# Altium project eps.PrjPCB (part 1 of 2)
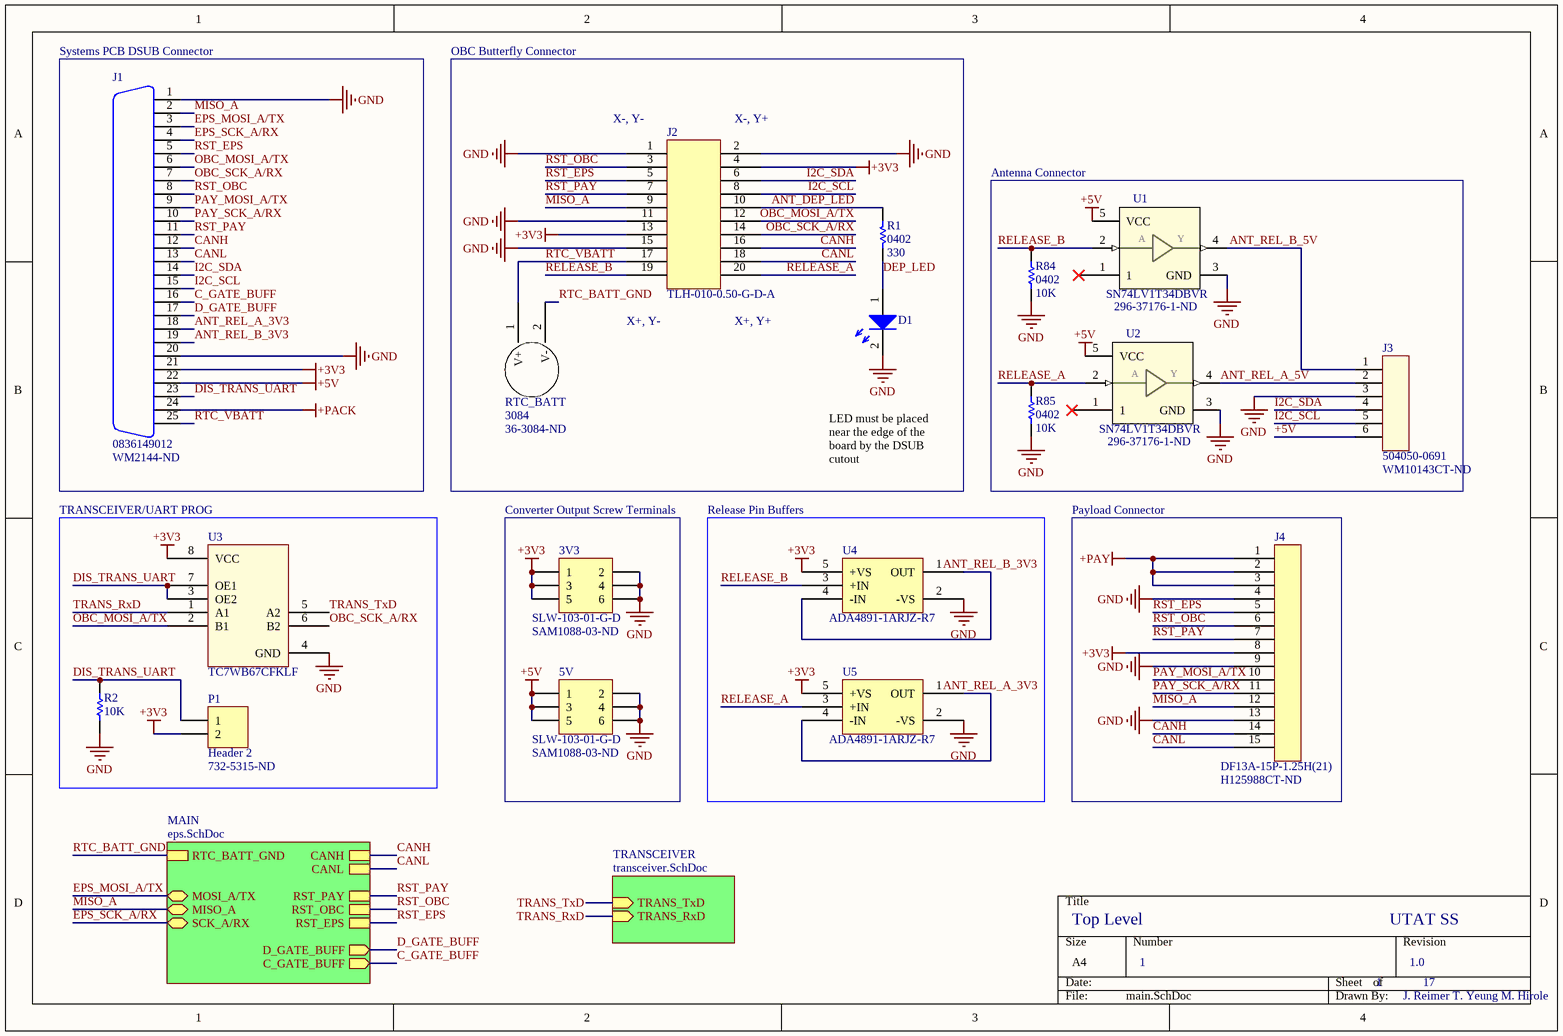
[diagram p0: main.SchDoc]
13 sheets, 165 parts. Net scope: hierarchical (ports join the sheet entries above them; power ports are global).
Board files: eps.PcbDoc, eps-flight.PcbDoc
Sheets:
  main.SchDoc
    MAIN = eps.SchDoc
      DIGITAL = eps_digital.SchDoc
        HEATERS AND SENSORS = heaters-sensors.SchDoc
        IMU = eps_imu.SchDoc
      BATTERY = batt.SchDoc
        LOAD SWITCHES = dep-switches.SchDoc
          DEP+ = dep-switch-TPS22959DNYT.SchDoc
          DEP- = dep-switch-TPS22959DNYT.SchDoc
          PAY LOAD SWITCH = dep-switch-TPS22959DNYT.SchDoc
        CURRENT LIMITER = current-limiter.SchDoc
        RBF = dep-switch-TPS22959DNYT.SchDoc
      BOOST = boost.SchDoc
      BUCK-BOOST = buck_boost.SchDoc
      SOLAR PANELS = solar.SchDoc
    TRANSCEIVER = transceiver.SchDoc

## Sheet main.SchDoc: Top Level
size A4; DrawnBy: J. Reimer T. Yeung M. Hirole; Organization: UTAT SS; DocumentNumber: 1; Revision: 1.0; SheetNumber: 1; SheetTotal: 17

### Parts
3V3  SLW-103-01-G-D  Supplier Part Number 1: SAM1088-03-ND  [SLW-103-01-X-D]
5V  SLW-103-01-G-D  Supplier Part Number 1: SAM1088-03-ND  [SLW-103-01-X-D]
D1  (no value)  [LED0603]
J1  0836149012  Supplier Part Number 1: WM2144-ND  [0836149012]
J2  TLH-010-0.50-G-D-A  [TLH-010-0.50-G-D-A]
J3  504050-0691  Supplier Part Number 1: WM10143CT-ND  [MOLEX_504050-0691]
J4  DF13A-15P-1.25H(21)  Supplier Part Number 1: H125988CT-ND  [DF13A-15P-1.25H(21)]
P1  Header 2  Supplier Part Number 1: 732-5315-ND  [HDR1X2]
R1  0402  value 330  [RES0402R]
R2  value 10K  [RES0402R]  (hidden comment: 0402)
R84  0402  value 10K  [RES0402R]
R85  0402  value 10K  [RES0402R]
RTC_BATT  3084  Supplier Part Number 1: 36-3084-ND  [3084]
U1  SN74LV1T34DBVR  Supplier Part Number 1: 296-37176-1-ND  [SOT95P280X145-5N]
U2  SN74LV1T34DBVR  Supplier Part Number 1: 296-37176-1-ND  [SOT95P280X145-5N]
U3  TC7WB67CFKLF  [US8]
U4  ADA4891-1ARJZ-R7  [SOT-23-5]
U5  ADA4891-1ARJZ-R7  [SOT-23-5]

### Blocks framed on the sheet
Systems PCB DSUB Connector: J1
Antenna Connector: J3 R84 R85 U1 U2
TRANSCEIVER/UART PROG: P1 R2 U3
Converter Output Screw Terminals: 3V3 5V
Release Pin Buffers: U4 U5
Payload Connector: J4

### Sub-sheets
MAIN = eps.SchDoc: RST_PAY, RST_OBC, RST_EPS, SCK_A/RX (bidir), MOSI_A/TX (bidir), MISO_A (bidir), CANL, CANH, RTC_BATT_GND, D_GATE_BUFF (out), C_GATE_BUFF (out)
TRANSCEIVER = transceiver.SchDoc: TRANS_RxD (in), TRANS_TxD (in)

### Nets
+3V3: 3V3.1 3V3.3 3V3.5 J1.21 J2.4 J2.13 J4.8 P1.2 U3.8(VCC) U4.5(+VS) U5.5(+VS)
+5V: 5V.1 5V.3 5V.5 J1.22 J3.6 U1.5(VCC) U2.5(VCC)
+PACK: J1.24
+PAY: J4.1 J4.2 J4.3
GND: 3V3.2 3V3.4 3V3.6 5V.2 5V.4 5V.6 D1.2 J1.1 J1.20 J2.1 J2.2 J2.11 J2.15 J3.3 J4.4 J4.9 J4.13 R2.2 R84.1 R85.1 U1.3(GND) U2.3(GND) U3.4(GND) U4.2(-VS) U5.2(-VS)
RTC_BATT_GND: RTC_BATT.2(V-) ; sheet MAIN/RTC_BATT_GND  [project net -PACK_RAW]
ANT_DEP_LED: J2.10 R1.2
ANT_REL_A_3V3: J1.18 U5.1(OUT) U5.4(-IN)
ANT_REL_A_5V: J3.2 U2.4(Y)
ANT_REL_B_3V3: J1.19 U4.1(OUT) U4.4(-IN)
ANT_REL_B_5V: J3.1 U1.4(Y)
C_GATE_BUFF: J1.16 ; sheet MAIN/C_GATE_BUFF
CANH: J1.12 J2.16 J4.14 ; sheet MAIN/CANH
CANL: J1.13 J2.18 J4.15 ; sheet MAIN/CANL
D_GATE_BUFF: J1.17 ; sheet MAIN/D_GATE_BUFF
DEP_LED: D1.1 R1.1
DIS_TRANS_UART: J1.23 P1.1 R2.1 U3.3(OE2) U3.7(OE1)
EPS_MOSI_A/TX: J1.3 ; sheet MAIN/MOSI_A/TX
EPS_SCK_A/RX: J1.4 ; sheet MAIN/SCK_A/RX
I2C_SCL: J1.15 J2.8 J3.5
I2C_SDA: J1.14 J2.6 J3.4
MISO_A: J1.2 J2.9 J4.12 ; sheet MAIN/MISO_A
OBC_MOSI_A/TX: J1.6 J2.12 U3.2(B1)
OBC_SCK_A/RX: J1.7 J2.14 U3.6(B2)
PAY_MOSI_A/TX: J1.9 J4.10
PAY_SCK_A/RX: J1.10 J4.11
RELEASE_A: J2.20 R85.2 U2.2(A) U5.3(+IN)
RELEASE_B: J2.19 R84.2 U1.2(A) U4.3(+IN)
RST_EPS: J1.5 J2.5 J4.5 ; sheet MAIN/RST_EPS
RST_OBC: J1.8 J2.3 J4.6 ; sheet MAIN/RST_OBC
RST_PAY: J1.11 J2.7 J4.7 ; sheet MAIN/RST_PAY
RTC_VBATT: J1.25 J2.17 RTC_BATT.1(V+)
TRANS_RxD: U3.1(A1) ; sheet TRANSCEIVER/TRANS_RxD
TRANS_TxD: U3.5(A2) ; sheet TRANSCEIVER/TRANS_TxD

Not connected (* = marked no-connect by the designer): U1 1*; U2 1*

### Notes on the sheet
- OBC Butterfly Connector
- (near J2) X-, Y-
- (near J2) X-, Y+
- (near J2) X+, Y-
- (near J2) X+, Y+
- LED must be placed near the edge of the board by the DSUB cutout

### Library data of the parts
3V3 5V = SLW-103-01-G-D: 6 pos 100mil pitch low profile header; Supplier 1: Digi-Key
D1 = LED: Just a generic LED
J1 = 0836149012: Mini-DSUB 25-pos Connector; Supplier 1: Digi-Key
J2 = TLH-010-0.50-G-D-A: 0.50 mm Razor Beam LP Ultra Low Profile Terminal Strip, alignment pin option; Supplier 1: Samtec; ComponentLink1Description: Product Page; ComponentLink1URL: https://www.samtec.com/products/tlh-010-0.50-g-d-a; Supplier Part Number 1: TLH-010-0.50-G-D-A
J3 = 504050-0691: Wire-To-Board Connector, Pico-Lock 504050 Series, Surface Mount, Header, 6, 1.5 mm; Supplier 1: Digi-Key
J4 = DF13A-15P-1.25H(21): 15 pos DF13 right angle surface mount connector; Supplier 1: Digi-Key
P1 = Header 2: Header, 2-Pin; LatestRevisionDate: 17-Jul-2002; LatestRevisionNote: Re-released for DXP Platform.; Publisher: Altium Limited; Supplier 1: Digi-Key
R1 R2 R84 R85 = RES0402: 0402 resistor
RTC_BATT = 3084: CR2330 Battery Holder; Manufacturer: Keystone Electronics; Number of Batteries: 2; Number of Cells: 1; Supplier 1: Digi-Key; Manufacturer Part Number: 3084; Stock 1: 658; Pricing 1: 1=0.62, 10=0.523, 50=0.4586, 250=0.39796, 500=0.391, 1000=0.34946, 2500=0.31916, 5000=0.29492 (USD); Mount: Surface Mount,PCB; Case/Package: SMD/SMT; Package Quantity: 100; Termination: SMD/SMT; Lead Free: Lead Free; REACH SVHC: No SVHC; ComponentLink1URL: http://media.digikey.com/pdf/Data%20Sheets/Keystone%20Electronics%20PDFs/Lithium_Coin_Cell_Retainers_SMT.pdf?src-supplier=Digi-Key; ComponentLink1Description: http://media.digikey.com/pdf/Data%20Sheets/Keystone%20Electronics%20PDFs/Lithium_Coin_Cell_Retainers_SMT.pdf?src-supplier=Digi-Key
U1 U2 = SN74LV1T34DBVR: Single Power Supply BUFFER Logic Level Shifter _no enable_ 5-SOT-23 -40 to 125; MF: Texas Instruments; Number of Elements: 1; Logic Function: Buffer,Inverting; Max Supply Voltage: 5.5V; Min Supply Voltage: 1.6V; High Level Output Current: -8mA; Low Level Output Current: 8mA; Polarity: Non-Inverting; Propagation Delay: 15.5ns; Quiescent Current: 1uA; SnapEDA_Link: https://www.snapeda.com/parts/SN74LV1T34DBVR/Texas%20Instruments/view-part/?ref=snap; MP: SN74LV1T34DBVR; Package: SOT-23 Texas Instruments; Digi-Key_Purchase_URL: https://www.digikey.ca/product-detail/en/texas-instruments/SN74LV1T34DBVR/296-37176-1-ND/4555593?utm_source=snapeda&utm_medium=aggregator&utm_campaign=symbol; Digi-Key_Part_Number: 296-37176-1-ND; Value: *; Supplier 1: Digi-Key; Manufacturer: Texas Instruments; Manufacturer Part Number: SN74LV1T34DBVR; Stock 1: 39936; Pricing 1: 1=0.47, 10=0.378, 100=0.2571, 500=0.19282, 1000=0.14461 (USD); Mount: Surface Mount; Case/Package: SOT-23-5; Number of Pins: 5; Weight: 0.000353oz; Min Operating Temperature: -40°C; Max Operating Temperature: 125°C; Package Quantity: 3000; Packaging: Tape and Reel; Number of Bits per Element: 1; Number of Input Lines: 1; Number of Output Lines: 1; Operating Supply Current: 8mA; Number of Channels: 1; Number of Inputs: 1; Number of Outputs: 1; Number of Bits: 1; Radiation Hardening: No; REACH SVHC: No SVHC; Lead Free: Lead Free; ComponentLink1URL: http://www.ti.com/lit/pdf/sdyu001?src-supplier=Digi-Key; ComponentLink1Description: http://www.ti.com/lit/pdf/sdyu001?src-supplier=Digi-Key; ComponentLink2URL: http://www.ti.com/lit/ds/symlink/sn74lv1t34.pdf?src-supplier=Avnet; ComponentLink2Description: http://www.ti.com/lit/ds/symlink/sn74lv1t34.pdf?src-supplier=Avnet
U3 = TC7WB66CFKLF: Active high bus switch; Manufacturer: Toshiba; Manufacturer Part Number: TC7WB67CFK,LF(CT; Supplier 1: Digi-Key; Supplier 2: Digi-Key; Stock 2: 5593; Pricing 2: 1=0.41, 10=0.32, 25=0.27, 100=0.2199, 250=0.1822, 500=0.1508, 1000=0.11309 (USD); Supplier Part Number 2: TC7WB67CFKLF(CTCT-ND
U4 U5 = ADA4891-1ARJZ-R7: Rail-to-rail amplifier 125mA max; Vendor: Analog Devices Inc; Built_By: EMA_UL_Team; Manufacturer_Part_Number: ADA4891-1ARJZ-R7; Copyright: Copyright (C) 2018 Accelerated Designs. All rights reserved; RefDes: RefDes; Type: DEV; Value: Value; Supplier 1: Digi-Key; Supplier Part Number 1: ADA4891-1ARJZ-R7CT-ND

## Sheet eps.SchDoc: Power Top Level
size A; DrawnBy: J. Reimer T. Yeung M. Hirole; Organization: UTAT SS; DocumentNumber: 2; Revision: 1.0; SheetNumber: 2; SheetTotal: 17
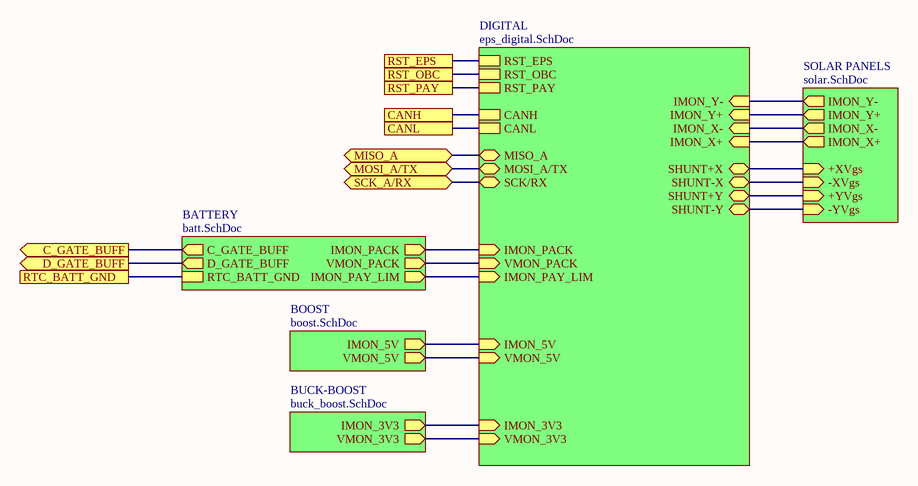
[diagram p1: eps.SchDoc]

### Sub-sheets
BATTERY = batt.SchDoc: IMON_PACK (out), VMON_PACK (out), RTC_BATT_GND, C_GATE_BUFF (out), D_GATE_BUFF (out), IMON_PAY_LIM (out)
BOOST = boost.SchDoc: VMON_5V (out), IMON_5V (out)
BUCK-BOOST = buck_boost.SchDoc: IMON_3V3 (out), VMON_3V3 (out)
DIGITAL = eps_digital.SchDoc: RST_EPS, RST_OBC, RST_PAY, CANH, CANL, MISO_A (bidir), MOSI_A/TX (bidir), SCK/RX (bidir), VMON_5V (in), IMON_5V (in), IMON_3V3 (in), IMON_X+ (in), IMON_X- (in), IMON_Y+ (in), VMON_PACK (in), IMON_Y- (in), SHUNT-Y (bidir), SHUNT+Y (bidir), VMON_3V3 (in), SHUNT-X (bidir), SHUNT+X (bidir), IMON_PACK (in), IMON_PAY_LIM (in)
SOLAR PANELS = solar.SchDoc: IMON_Y+ (out), IMON_Y- (out), -YVgs (in), IMON_X+ (out), +YVgs (in), +XVgs (in), -XVgs (in), IMON_X- (out)

### Ports
C_GATE_BUFF (out), CANH, CANL, D_GATE_BUFF (out), MISO_A (bidir), MOSI_A/TX (bidir), RST_EPS, RST_OBC, RST_PAY, RTC_BATT_GND, SCK_A/RX (bidir)

### Nets
-PACK_RAW: port RTC_BATT_GND, sheet BATTERY/RTC_BATT_GND
C_GATE_BUFF: port C_GATE_BUFF, sheet BATTERY/C_GATE_BUFF
CANH: port CANH, sheet DIGITAL/CANH
CANL: port CANL, sheet DIGITAL/CANL
D_GATE_BUFF: port D_GATE_BUFF, sheet BATTERY/D_GATE_BUFF
EPS_MOSI_A/TX: port MOSI_A/TX, sheet DIGITAL/MOSI_A/TX
EPS_SCK_A/RX: port SCK_A/RX, sheet DIGITAL/SCK/RX
G1: sheet DIGITAL/SHUNT+X, sheet SOLAR PANELS/+XVgs
G2: sheet DIGITAL/SHUNT-X, sheet SOLAR PANELS/-XVgs
G3: sheet DIGITAL/SHUNT+Y, sheet SOLAR PANELS/+YVgs
G4: sheet DIGITAL/SHUNT-Y, sheet SOLAR PANELS/-YVgs
IMON_3V3: sheet DIGITAL/IMON_3V3, sheet BUCK-BOOST/IMON_3V3
IMON_5V: sheet DIGITAL/IMON_5V, sheet BOOST/IMON_5V
MISO_A: port MISO_A, sheet DIGITAL/MISO_A
PACK_IMON: sheet DIGITAL/IMON_PACK, sheet BATTERY/IMON_PACK
PACK_VMON: sheet DIGITAL/VMON_PACK, sheet BATTERY/VMON_PACK
RST_EPS: port RST_EPS, sheet DIGITAL/RST_EPS
RST_OBC: port RST_OBC, sheet DIGITAL/RST_OBC
RST_PAY: port RST_PAY, sheet DIGITAL/RST_PAY
VMON_3V3: sheet DIGITAL/VMON_3V3, sheet BUCK-BOOST/VMON_3V3
VMON_5V: sheet DIGITAL/VMON_5V, sheet BOOST/VMON_5V
NetR83_2: sheet DIGITAL/IMON_PAY_LIM, sheet BATTERY/IMON_PAY_LIM
(unnamed): sheet DIGITAL/IMON_X+, sheet SOLAR PANELS/IMON_X+
(unnamed): sheet DIGITAL/IMON_X-, sheet SOLAR PANELS/IMON_X-
(unnamed): sheet DIGITAL/IMON_Y+, sheet SOLAR PANELS/IMON_Y+
(unnamed): sheet DIGITAL/IMON_Y-, sheet SOLAR PANELS/IMON_Y-

## Sheet eps_digital.SchDoc: Digital Top Level
size A4; DrawnBy: J. Reimer T. Yeung M. Au; Organization: UTAT SS; DocumentNumber: 7; Revision: 2.0; SheetNumber: 7; SheetTotal: 17
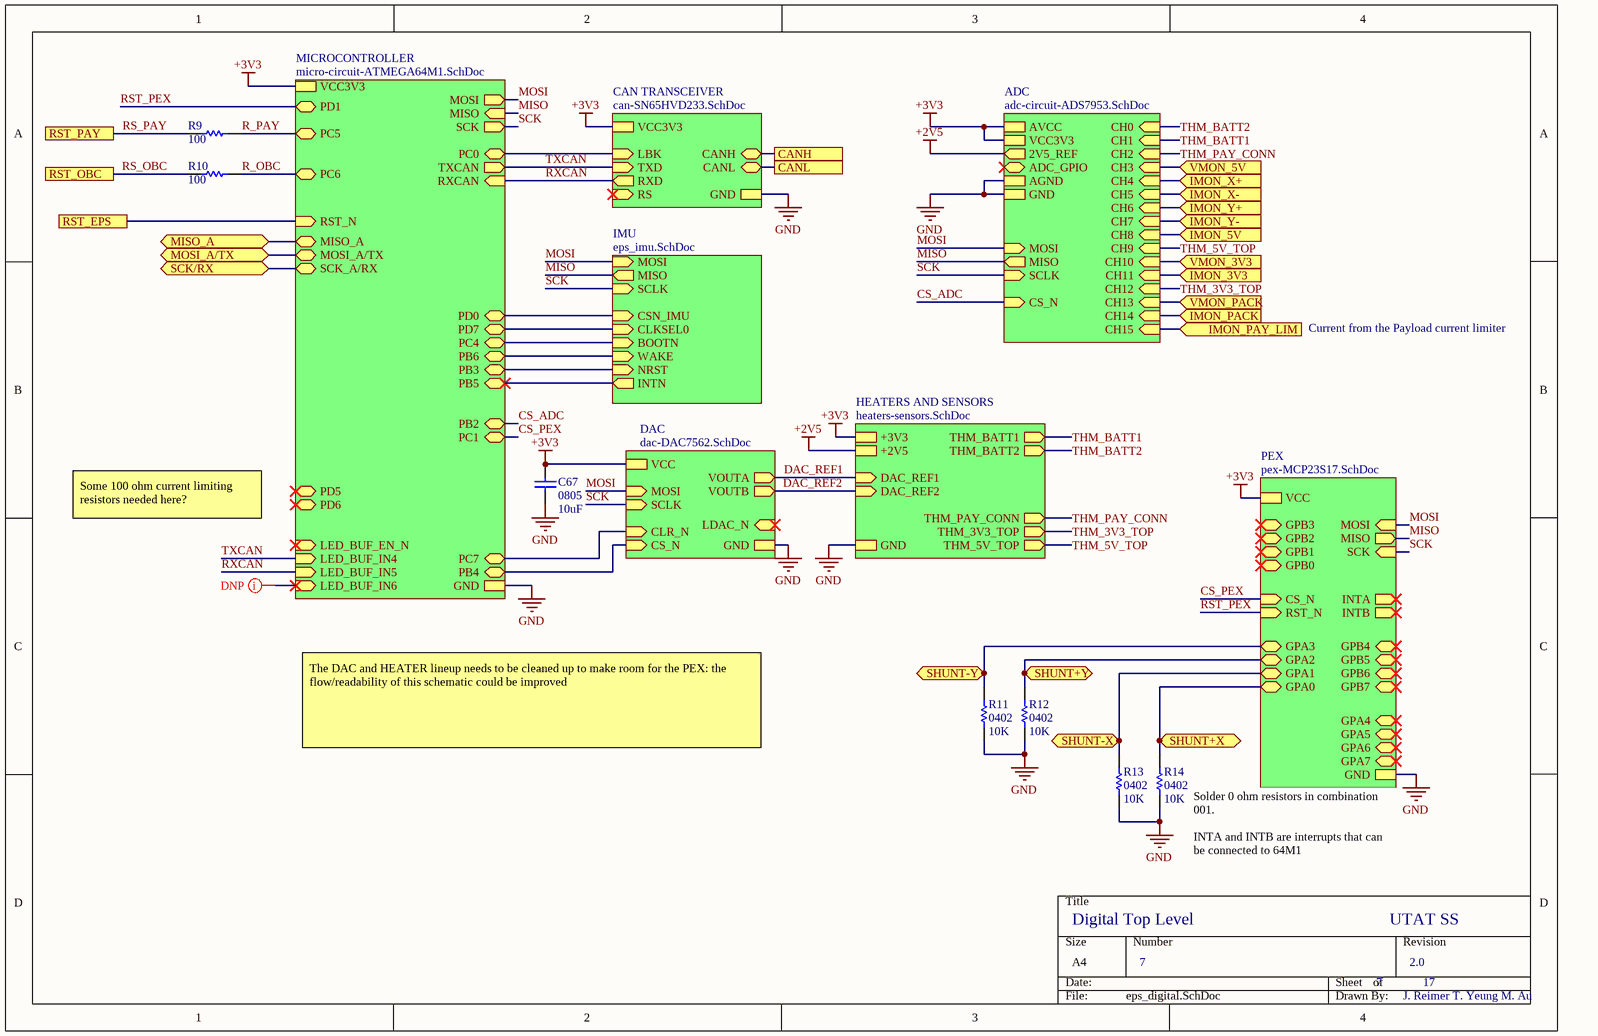
[diagram p2: eps_digital.SchDoc]

### Parts
C67  0805  value 10uF  [CAP0805R]
R9  value 100  [RES0402R]  (hidden comment: 0402)
R10  value 100  [RES0402R]  (hidden comment: 0402)
R11  0402  value 10K  [RES0402R]
R12  0402  value 10K  [RES0402R]
R13  0402  value 10K  [RES0402R]
R14  0402  value 10K  [RES0402R]

### Sub-sheets
ADC = adc-circuit-ADS7953.SchDoc (file not in this document): CH10 (in), CH11 (in), CH9 (in), CH5 (in), CH6 (in), CH7 (in), CH3 (in), CH2 (in), CH8 (in), CH4 (in), CH1 (in), CH0 (in), CS_N (in), AVCC, ADC_GPIO (bidir), 2V5_REF (out), VCC3V3, AGND, GND, MISO (out), MOSI (in), SCLK (in), CH12 (in), CH14 (in), CH13 (in), CH15 (in)
CAN TRANSCEIVER = can-SN65HVD233.SchDoc (file not in this document): RXD (out), TXD (in), LBK (in), CANL (bidir), CANH (bidir), RS (in), VCC3V3, GND
DAC = dac-DAC7562.SchDoc (file not in this document): MOSI (in), CLR_N (in), SCLK (in), CS_N (in), VOUTB (out), VOUTA (out), VCC, GND, LDAC_N (in)
HEATERS AND SENSORS = heaters-sensors.SchDoc: +2V5, DAC_REF1 (in), GND, DAC_REF2 (in), +3V3, THM_BATT1 (out), THM_BATT2 (out), THM_3V3_TOP (out), THM_5V_TOP (out), THM_PAY_CONN (out)
IMU = eps_imu.SchDoc: NRST (in), CSN_IMU (in), MISO (out), CLKSEL0 (in), WAKE (in), BOOTN (in), INTN (out), SCLK (in), MOSI (in)
MICROCONTROLLER = micro-circuit-ATMEGA64M1.SchDoc (file not in this document): MOSI_A/TX (bidir), TXCAN (out), RXCAN (in), SCK_A/RX (bidir), PC6 (bidir), PC5 (bidir), PD1 (bidir), PB5 (bidir), PC1 (bidir), PB2 (bidir), RST_N (in), PC0 (bidir), MISO_A (bidir), PB4 (bidir), PD7 (bidir), PB3 (bidir), VCC3V3, PB6 (bidir), PD6 (bidir), GND, LED_BUF_IN6 (in), LED_BUF_IN5 (in), LED_BUF_IN4 (in), LED_BUF_EN_N (in), PD0 (bidir), PD5 (bidir), PC4 (bidir), PC7 (bidir), MISO (in), SCK (out), MOSI (out)
PEX = pex-MCP23S17.SchDoc (file not in this document): GPB0 (bidir), GPB1 (bidir), GPB2 (bidir), GPB3 (bidir), GPA1 (bidir), GPA2 (bidir), GPA0 (bidir), GPA3 (bidir), CS_N (in), RST_N (in), MISO (out), MOSI (in), SCK (in), GND, INTB (out), INTA (out), VCC, GPB6 (bidir), GPA6 (bidir), GPB5 (bidir), GPB7 (bidir), GPA4 (bidir), GPA5 (bidir), GPA7 (bidir), GPB4 (bidir)

### Ports
CANH, CANL, IMON_3V3 (in), IMON_5V (in), IMON_PACK (in), IMON_PAY_LIM (in), IMON_X+ (in), IMON_X- (in), IMON_Y+ (in), IMON_Y- (in), MISO_A (bidir), MOSI_A/TX (bidir), RST_EPS, RST_OBC, RST_PAY, SCK/RX (bidir), SHUNT+X (bidir), SHUNT+Y (bidir), SHUNT-X (bidir), SHUNT-Y (bidir), VMON_3V3 (in), VMON_5V (in), VMON_PACK (in)

### Nets
+2V5: sheet ADC/2V5_REF, sheet HEATERS AND SENSORS/+2V5
+3V3: C67.2 ; sheet MICROCONTROLLER/VCC3V3, sheet DAC/VCC, sheet ADC/AVCC, sheet ADC/VCC3V3, sheet HEATERS AND SENSORS/+3V3, sheet CAN TRANSCEIVER/VCC3V3, sheet PEX/VCC
GND: C67.1 R11.1 R12.1 R13.1 R14.1 ; sheet MICROCONTROLLER/GND, sheet DAC/GND, sheet ADC/AGND, sheet ADC/GND, sheet HEATERS AND SENSORS/GND, sheet CAN TRANSCEIVER/GND, sheet PEX/GND
CANH: port CANH, sheet CAN TRANSCEIVER/CANH
CANL: port CANL, sheet CAN TRANSCEIVER/CANL
CS_ADC: sheet MICROCONTROLLER/PB2, sheet ADC/CS_N
CS_PEX: sheet MICROCONTROLLER/PC1, sheet PEX/CS_N
DAC_REF1: sheet DAC/VOUTA, sheet HEATERS AND SENSORS/DAC_REF1
DAC_REF2: sheet DAC/VOUTB, sheet HEATERS AND SENSORS/DAC_REF2
EPS_MOSI_A/TX: port MOSI_A/TX, sheet MICROCONTROLLER/MOSI_A/TX
EPS_SCK_A/RX: port SCK/RX, sheet MICROCONTROLLER/SCK_A/RX
G1: R14.2 ; port SHUNT+X, sheet PEX/GPA0
G2: R13.2 ; port SHUNT-X, sheet PEX/GPA1
G3: R12.2 ; port SHUNT+Y, sheet PEX/GPA2
G4: R11.2 ; port SHUNT-Y, sheet PEX/GPA3
IMON_3V3: port IMON_3V3, sheet ADC/CH11
IMON_5V: port IMON_5V, sheet ADC/CH8
MISO: sheet MICROCONTROLLER/MISO, sheet ADC/MISO, sheet IMU/MISO, sheet PEX/MISO
MISO_A: port MISO_A, sheet MICROCONTROLLER/MISO_A
MOSI: sheet MICROCONTROLLER/MOSI, sheet DAC/MOSI, sheet ADC/MOSI, sheet IMU/MOSI, sheet PEX/MOSI
PACK_IMON: port IMON_PACK, sheet ADC/CH14
PACK_VMON: port VMON_PACK, sheet ADC/CH13
R_OBC: R10.2 ; sheet MICROCONTROLLER/PC6
R_PAY: R9.2 ; sheet MICROCONTROLLER/PC5
RS_OBC: R10.1 ; port RST_OBC  [project net RST_OBC]
RS_PAY: R9.1 ; port RST_PAY  [project net RST_PAY]
RST_EPS: port RST_EPS, sheet MICROCONTROLLER/RST_N
RST_PEX: sheet MICROCONTROLLER/PD1, sheet PEX/RST_N
RXCAN: sheet MICROCONTROLLER/RXCAN, sheet MICROCONTROLLER/LED_BUF_IN5, sheet CAN TRANSCEIVER/RXD
SCK: sheet MICROCONTROLLER/SCK, sheet DAC/SCLK, sheet ADC/SCLK, sheet IMU/SCLK, sheet PEX/SCK
THM_3V3_TOP: sheet ADC/CH12, sheet HEATERS AND SENSORS/THM_3V3_TOP
THM_5V_TOP: sheet ADC/CH9, sheet HEATERS AND SENSORS/THM_5V_TOP
THM_BATT1: sheet ADC/CH1, sheet HEATERS AND SENSORS/THM_BATT1
THM_BATT2: sheet ADC/CH0, sheet HEATERS AND SENSORS/THM_BATT2
THM_PAY_CONN: sheet ADC/CH2, sheet HEATERS AND SENSORS/THM_PAY_CONN
TXCAN: sheet MICROCONTROLLER/TXCAN, sheet MICROCONTROLLER/LED_BUF_IN4, sheet CAN TRANSCEIVER/TXD
VMON_3V3: port VMON_3V3, sheet ADC/CH10
VMON_5V: port VMON_5V, sheet ADC/CH3
NetR47_1: sheet MICROCONTROLLER/PC4, sheet IMU/BOOTN
NetR48_1: sheet MICROCONTROLLER/PD0, sheet IMU/CSN_IMU
NetR83_2: port IMON_PAY_LIM, sheet ADC/CH15
NetU13_6: sheet MICROCONTROLLER/PB6, sheet IMU/WAKE
NetU13_10: sheet MICROCONTROLLER/PD7, sheet IMU/CLKSEL0
NetU13_11: sheet MICROCONTROLLER/PB3, sheet IMU/NRST
NetU13_14: sheet MICROCONTROLLER/PB5, sheet IMU/INTN
(unnamed): port IMON_X+, sheet ADC/CH4
(unnamed): port IMON_X-, sheet ADC/CH5
(unnamed): port IMON_Y+, sheet ADC/CH6
(unnamed): port IMON_Y-, sheet ADC/CH7
(unnamed): sheet MICROCONTROLLER/PC0, sheet CAN TRANSCEIVER/LBK
(unnamed): sheet MICROCONTROLLER/PB4, sheet DAC/CS_N
(unnamed): sheet MICROCONTROLLER/PC7, sheet DAC/CLR_N

### Layout directives
mark named DNP: (no net found under the mark)

### Notes on the sheet
- Current from the Payload current limiter
- Some 100 ohm current limiting resistors needed here?
- The DAC and HEATER lineup needs to be cleaned up to make room for the PEX: the flow/readability of this schematic could be improved
- (near R14) Solder 0 ohm resistors in combination 001.
  INTA and INTB are interrupts that can be connected to 64M1

### Library data of the parts
C67 = CAP0805: 0805 capacitor
R9-R14 = RES0402: 0402 resistor

## Sheet heaters-sensors.SchDoc
size A4
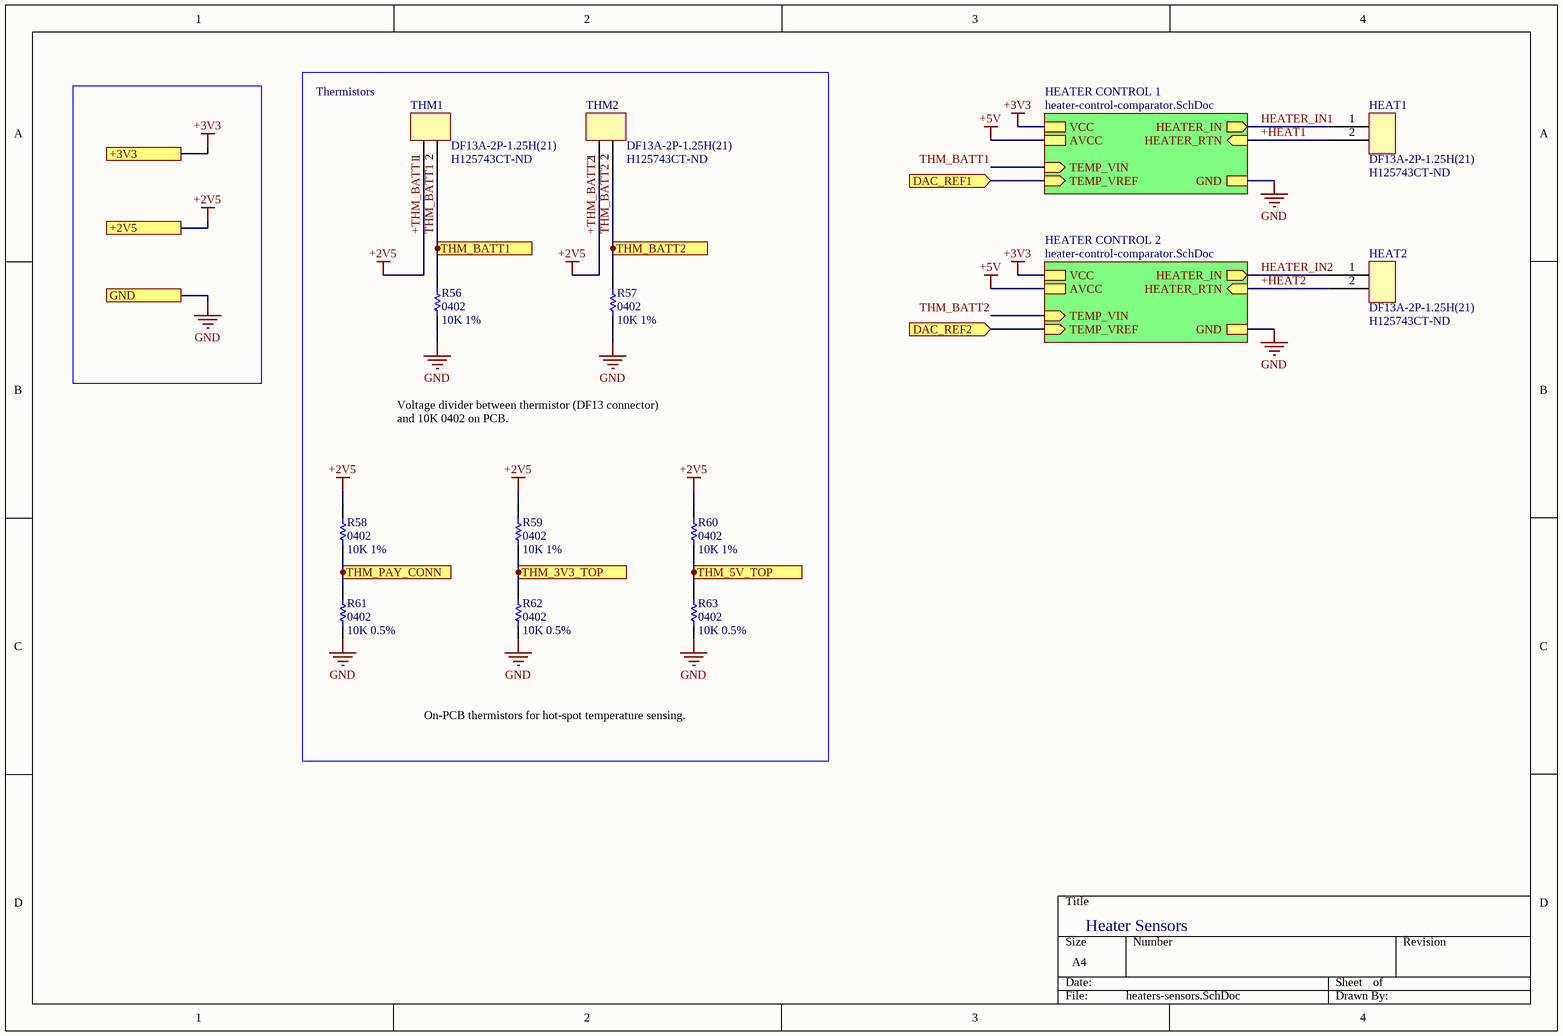
[diagram p3: heaters-sensors.SchDoc]

### Parts
HEAT1  DF13A-2P-1.25H(21)  Supplier Part Number 1: H125743CT-ND  [DF13A-2P-1.25H(21)]
HEAT2  DF13A-2P-1.25H(21)  Supplier Part Number 1: H125743CT-ND  [DF13A-2P-1.25H(21)]
R56  0402  value 10K 1%  [RES0402R]
R57  0402  value 10K 1%  [RES0402R]
R58  0402  value 10K 1%  [RES0402R]
R59  0402  value 10K 1%  [RES0402R]
R60  0402  value 10K 1%  [RES0402R]
R61  0402  value 10K 0.5%  [RES0402R]
R62  0402  value 10K 0.5%  [RES0402R]
R63  0402  value 10K 0.5%  [RES0402R]
THM1  DF13A-2P-1.25H(21)  Supplier Part Number 1: H125743CT-ND  [DF13A-2P-1.25H(21)]
THM2  DF13A-2P-1.25H(21)  Supplier Part Number 1: H125743CT-ND  [DF13A-2P-1.25H(21)]

### Blocks framed on the sheet
Thermistors: R56-R63 THM1 THM2

### Sub-sheets
HEATER CONTROL 1 = heater-control-comparator.SchDoc (file not in this document): GND, TEMP_VIN (in), TEMP_VREF (in), HEATER_IN (out), VCC, AVCC, HEATER_RTN (in)
HEATER CONTROL 2 = heater-control-comparator.SchDoc (file not in this document): GND, TEMP_VIN (in), TEMP_VREF (in), HEATER_IN (out), VCC, AVCC, HEATER_RTN (in)

### Ports
+2V5, +3V3, DAC_REF1 (in), DAC_REF2 (in), GND, THM_3V3_TOP (out), THM_5V_TOP (out), THM_BATT1 (out), THM_BATT2 (out), THM_PAY_CONN (out)

### Nets
+2V5: R58.2 R59.2 R60.2 THM1.1 THM2.1 ; port +2V5  [also labelled +THM_BATT1, +THM_BATT2]
+3V3: port +3V3, sheet HEATER CONTROL 1/VCC, sheet HEATER CONTROL 2/VCC
+5V: sheet HEATER CONTROL 1/AVCC, sheet HEATER CONTROL 2/AVCC
GND: R56.1 R57.1 R61.1 R62.1 R63.1 ; port GND, sheet HEATER CONTROL 1/GND, sheet HEATER CONTROL 2/GND
+HEAT1: HEAT1.2 ; sheet HEATER CONTROL 1/HEATER_RTN
+HEAT2: HEAT2.2 ; sheet HEATER CONTROL 2/HEATER_RTN
DAC_REF1: port DAC_REF1, sheet HEATER CONTROL 1/TEMP_VREF
DAC_REF2: port DAC_REF2, sheet HEATER CONTROL 2/TEMP_VREF
HEATER_IN1: HEAT1.1 ; sheet HEATER CONTROL 1/HEATER_IN
HEATER_IN2: HEAT2.1 ; sheet HEATER CONTROL 2/HEATER_IN
THM_3V3_TOP: R59.1 R62.2 ; port THM_3V3_TOP
THM_5V_TOP: R60.1 R63.2 ; port THM_5V_TOP
THM_BATT1: R56.2 THM1.2 ; port THM_BATT1, sheet HEATER CONTROL 1/TEMP_VIN
THM_BATT2: R57.2 THM2.2 ; port THM_BATT2, sheet HEATER CONTROL 2/TEMP_VIN
THM_PAY_CONN: R58.1 R61.2 ; port THM_PAY_CONN

### Notes on the sheet
- Voltage divider between thermistor (DF13 connector) and 10K 0402 on PCB.
- On-PCB thermistors for hot-spot temperature sensing.
- Heater Sensors

### Library data of the parts
HEAT1 HEAT2 THM1 THM2 = DF13A-2P-1.25H(21): 2 pos DF13 right angle surface mount connector; Supplier 1: Digi-Key
R56-R60 = RES0402: 0402 resistor
R61-R63 = RES0402: 0402 thermistor; Supplier 1: Digi-Key; Supplier Part Number 1: 490-12810-1-ND

## Sheet eps_imu.SchDoc: Inertial Measurement Unit
size A; DrawnBy: Mohamed Hirole; Organization: UTAT SS; DocumentNumber: 8; Revision: 1.0; SheetNumber: 8; SheetTotal: 17
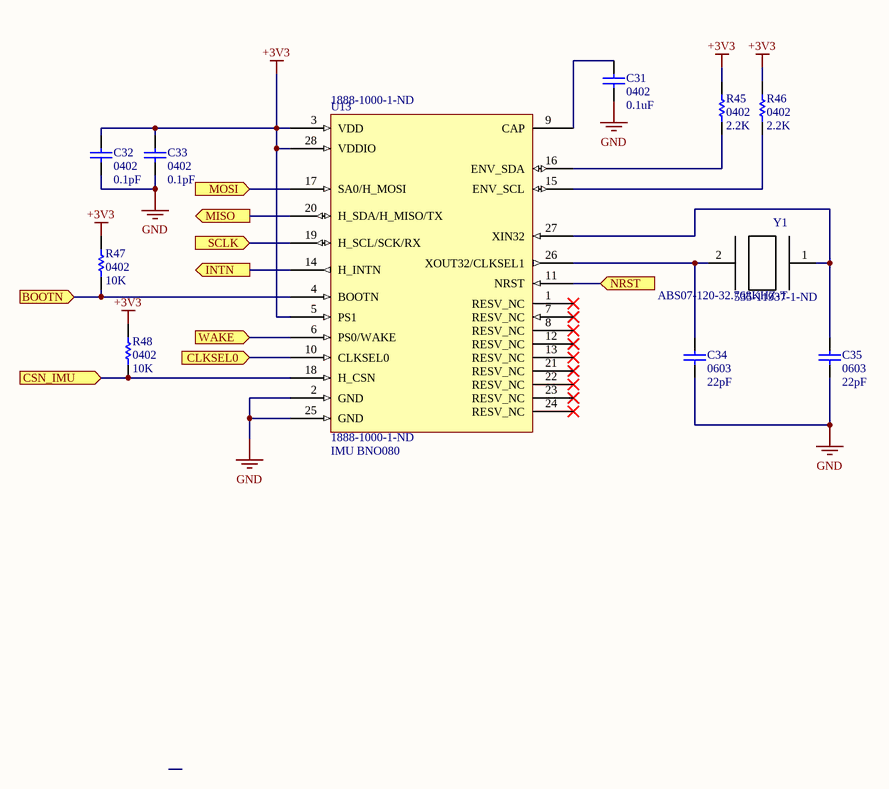
[diagram p4: eps_imu.SchDoc]

### Parts
C31  0402  value 0.1uF  [CAP0402R]
C32  0402  value 0.1pF  [CAP0402R]
C33  0402  value 0.1pF  [CAP0402R]
C34  0603  value 22pF  [CAP0603R]
C35  0603  value 22pF  [CAP0603R]
R45  0402  value 2.2K  [RES0402R]
R46  0402  value 2.2K  [RES0402R]
R47  0402  value 10K  [RES0402R]
R48  0402  value 10K  [RES0402R]
U13  IMU BNO080  [1888-1000-1-ND]
Y1  ABS07-120-32.768KHZ-T  Supplier Part Number 1: 535-11937-1-ND  [ABS07-120-32.768]

### Ports
BOOTN (in), CLKSEL0 (in), CSN_IMU (in), INTN (out), MISO (out), MOSI (in), NRST (in), SCLK (in), WAKE (in)

### Nets
+3V3: C32.2 C33.2 R45.2 R46.2 R47.2 R48.2 U13.3(VDD) U13.5(PS1) U13.28(VDDIO)
GND: C31.1 C32.1 C33.1 C34.1 C35.1 U13.2(GND) U13.25(GND)
MISO: U13.20(H_SDA/H_MISO/TX) ; port MISO
MOSI: U13.17(SA0/H_MOSI) ; port MOSI
SCK: U13.19(H_SCL/SCK/RX) ; port SCLK
NetC31_2: C31.2 U13.9(CAP)
NetC34_2: C34.2 U13.26(XOUT32/CLKSEL1) Y1.2
NetC35_2: C35.2 U13.27(XIN32) Y1.1
NetR45_1: R45.1 U13.16(ENV_SDA)
NetR46_1: R46.1 U13.15(ENV_SCL)
NetR47_1: R47.1 U13.4(BOOTN) ; port BOOTN
NetR48_1: R48.1 U13.18(H_CSN) ; port CSN_IMU
NetU13_6: U13.6(PS0/WAKE) ; port WAKE
NetU13_10: U13.10(CLKSEL0) ; port CLKSEL0
NetU13_11: U13.11(NRST) ; port NRST
NetU13_14: U13.14(H_INTN) ; port INTN

Not connected (* = marked no-connect by the designer): U13 1(RESV_NC)* 7(RESV_NC)* 8(RESV_NC)* 12(RESV_NC)* 13(RESV_NC)* 21(RESV_NC)* 22(RESV_NC)* 23(RESV_NC)* 24(RESV_NC)*

### Notes on the sheet
- (in symbol IMU BNO080) 1888-1000-1-ND

### Library data of the parts
C31-C33 = CAP0402: 0402 capacitor
C34 C35 = CAP0603: 0603 capacitor
R45-R48 = RES0402: 0402 resistor
U13 = IMU BNO080: ACCEL/GYRO/MAG I2C 32BIT; Manufacturer: Hillcrest Laboratories; Sensor Type: Accelerometer,Gyroscope,Magnetometer; Output Type: SPI,I2C; Supplier 1: Digi-Key; Manufacturer Part Number: BNO080; Stock 1: 10778; Pricing 1: 1=13.48, 5=11.826, 10=10.643, 25=9.46, 50=8.7506, 100=7.568, 500=7.095, 1000=6.622 (USD); Mount: Surface Mount; Case/Package: LGA; Min Operating Temperature: -40°C; Max Operating Temperature: 85°C; Packaging: Tape and Reel; Supplier Part Number 1: 1888-1000-1-ND
Y1 = ABS07-120-32.768KHZ-T: 3.2 x 1.5mm, 32.768KHZ Xtal 6pf, 20ppm, -40+85C, ESR 60kOhm, ST Micro Ref Design Crystal for STM32L; MF: Abracon; ESR (Equivalent Series Resistance): 55kR; Series Resistance: 60kR; MP: ABS07-120-32.768KHZ-T; SnapEDA_Link: https://www.snapeda.com/parts/ABS07-120-32.768KHZ-T/Abracon%20LLC/view-part/?ref=snap; Package: SMD-2 Abracon; Price: 0.37 USD; Availability: Good; Value: *; Supplier 1: Digi-Key; Manufacturer: Abracon; Manufacturer Part Number: ABS07-120-32.768KHZ-T; Stock 1: 213739; Pricing 1: 1=0.57, 10=0.473, 50=0.4258, 100=0.3784, 500=0.35948, 1000=0.30272 (USD); Mount: Surface Mount; Case/Package: SMD/SMT; Number of Pins: 2; Min Operating Temperature: -40°C; Max Operating Temperature: 85°C; Tolerance: 20ppm; Frequency: 32.768kHz; Load Capacitance: 6pF; Frequency Tolerance: 20ppm; Packaging: Tape and Reel; Package Quantity: 3000; Termination: SMD/SMT; Length: 3.2mm; Height: 0.035inch; Width: 0.061inch; Depth: 1.5mm; Radiation Hardening: No; REACH SVHC: No SVHC; Lead Free: Lead Free; ComponentLink1URL: https://www.verical.com/server-webapp/html/getDatasheet?partID=722402&src-supplier=Verical; ComponentLink1Description: https://www.verical.com/server-webapp/html/getDatasheet?partID=722402&src-supplier=Verical; ComponentLink2URL: https://abracon.com/Support/PackageDrawing/Resonators/ABS07-120.PDF?src-supplier=Digi-Key; ComponentLink2Description: https://abracon.com/Support/PackageDrawing/Resonators/ABS07-120.PDF?src-supplier=Digi-Key; ComponentLink3URL: http://www.mouser.com/ds/2/3/ABS07-120-32.768kHz-T-218607.pdf?src-supplier=Mouser; ComponentLink3Description: http://www.mouser.com/ds/2/3/ABS07-120-32.768kHz-T-218607.pdf?src-supplier=Mouser

## Sheet batt.SchDoc: Battery Protection
size A4; DrawnBy: J. Reimer T. Yeung M. Hirole; Organization: UTAT SS; DocumentNumber: 4; Revision: 2.0; SheetNumber: 4; SheetTotal: 17
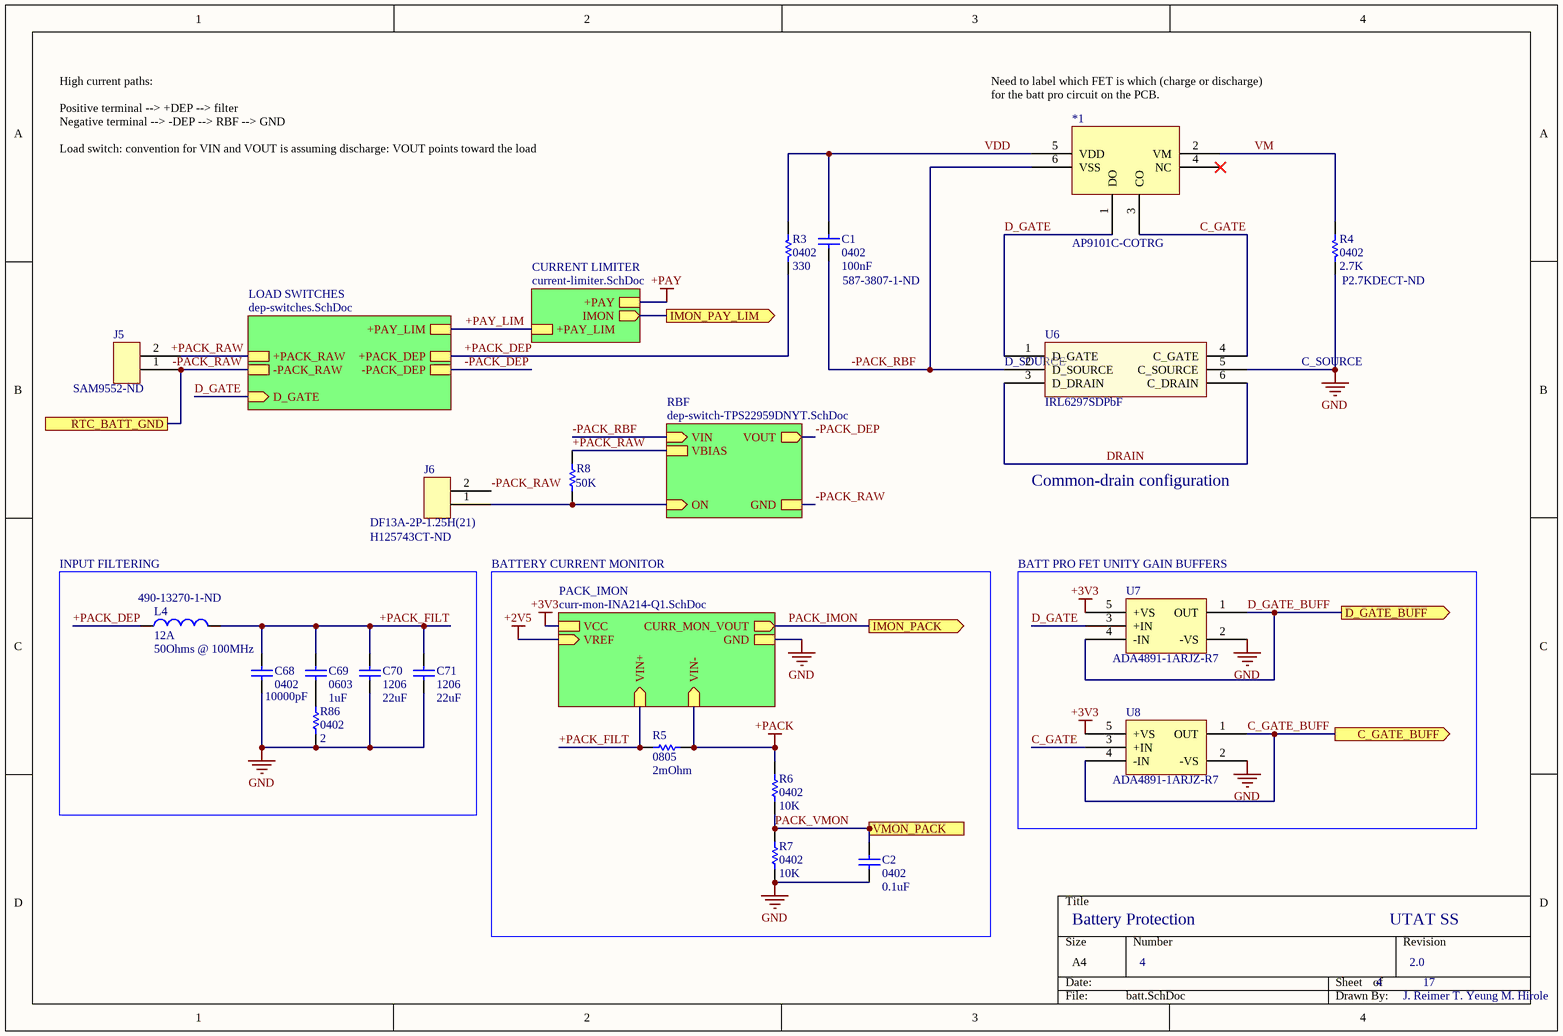
[diagram p5: batt.SchDoc]

### Parts
*1  AP9101C-COTRG  [SOT-26]
C1  0402  value 100nF  Supplier Part Number 1: 587-3807-1-ND  [CAP0402R]
C2  0402  value 0.1uF  [CAP0402R]
C68  0402  value 10000pF  [CAP0402R]
C69  0603  value 1uF  [CAP0603R]
C70  1206  value 22uF  [CAP1206R]
C71  1206  value 22uF  [CAP1206R]
J5  IPBT-102-H1-T-S-RA-K  [SAM9552-ND]  (value not drawn)
J6  DF13A-2P-1.25H(21)  Supplier Part Number 1: H125743CT-ND  [DF13A-2P-1.25H(21)]
L4  12A  value 50Ohms @ 100MHz  Supplier Part Number 3: 490-13270-1-ND  [CAP1206R]
R3  0402  value 330  [RES0402R]
R4  0402  value 2.7K  Supplier Part Number 1: P2.7KDECT-ND  [RES0402R]
R5  0805  value 2mOhm  [RES0805R]
R6  0402  value 10K  [RES0402R]
R7  0402  value 10K  [RES0402R]
R8  value 50K  [RES0402R]  (hidden comment: 0402)
R86  0402  value 2  [RES0402R]
U6  IRL6297SDPbF  [IRL6297SDPbF]
U7  ADA4891-1ARJZ-R7  [SOT-23-5]
U8  ADA4891-1ARJZ-R7  [SOT-23-5]

### Blocks framed on the sheet
INPUT FILTERING: C68-C71 L4 R86
BATTERY CURRENT MONITOR: C2 R5-R7
BATT PRO FET UNITY GAIN BUFFERS: U7 U8

### Sub-sheets
CURRENT LIMITER = current-limiter.SchDoc: +PAY_LIM, +PAY, IMON (out)
LOAD SWITCHES = dep-switches.SchDoc: +PACK_RAW, D_GATE (in), +PAY_LIM, -PACK_RAW, -PACK_DEP, +PACK_DEP
PACK_IMON = curr-mon-INA214-Q1.SchDoc (file not in this document): VREF (in), VIN+ (in), VCC, GND, VIN- (in), CURR_MON_VOUT (out)
RBF = dep-switch-TPS22959DNYT.SchDoc: VIN (in), VOUT (out), GND, VBIAS, ON (in)

### Ports
C_GATE_BUFF (out), D_GATE_BUFF (out), IMON_PACK (out), IMON_PAY_LIM (out), RTC_BATT_GND, VMON_PACK (out)

### Nets
+3V3: U7.5(+VS) U8.5(+VS) ; sheet PACK_IMON/VCC
+PACK: R5.2 R6.2 ; sheet PACK_IMON/VIN-
+PACK_RAW: J5.2 R8.2 ; sheet LOAD SWITCHES/+PACK_RAW, sheet RBF/VBIAS
-PACK_RAW: J5.1 J6.2 ; port RTC_BATT_GND, sheet LOAD SWITCHES/-PACK_RAW, sheet RBF/GND
GND: C2.1 C68.1 C70.1 C71.1 R4.1 R7.1 R86.1 U6.5(C_SOURCE) U7.2(-VS) U8.2(-VS) ; sheet PACK_IMON/GND
+PACK_DEP: L4.1 R3.2 ; sheet LOAD SWITCHES/+PACK_DEP
+PACK_FILT: C68.2 C69.2 C70.2 C71.2 L4.2 R5.1 ; sheet PACK_IMON/VIN+
+PAY_LIM: sheet LOAD SWITCHES/+PAY_LIM, sheet CURRENT LIMITER/+PAY_LIM
-PACK_DEP: sheet LOAD SWITCHES/-PACK_DEP, sheet RBF/VOUT
-PACK_RBF: *1.6(VSS) C1.1 U6.2(D_SOURCE) ; sheet RBF/VIN
C_GATE: *1.3(CO) U6.4(C_GATE) U8.3(+IN)
C_GATE_BUFF: U8.1(OUT) U8.4(-IN) ; port C_GATE_BUFF
D_GATE: *1.1(DO) U6.1(D_GATE) U7.3(+IN) ; sheet LOAD SWITCHES/D_GATE
D_GATE_BUFF: U7.1(OUT) U7.4(-IN) ; port D_GATE_BUFF
DRAIN: U6.3(D_DRAIN) U6.6(C_DRAIN)
PACK_IMON: port IMON_PACK, sheet PACK_IMON/CURR_MON_VOUT
PACK_VMON: C2.2 R6.1 R7.2 ; port VMON_PACK
VDD: *1.5(VDD) C1.2 R3.1
VM: *1.2(VM) R4.2
NetC69_1: C69.1 R86.2
NetJ6_1: J6.1 R8.1 ; sheet RBF/ON
NetR83_2: port IMON_PAY_LIM, sheet CURRENT LIMITER/IMON

Not connected (* = marked no-connect by the designer): *1 4(NC)*

### Notes on the sheet
- (near *1) Need to label which FET is which (charge or discharge) for the batt pro circuit on the PCB.
- High current paths:
  Positive terminal --> +DEP --> filter
  Negative terminal --> -DEP --> RBF --> GND
  Load switch: convention for VIN and VOUT is assuming discharge: VOUT points toward the load
- (near U6) D_SOURCE
- (near U6) C_SOURCE
- Common-drain configuration

### Library data of the parts
*1 = AP9101C-COTRG: Battery Protection IC
C1 = CAP0402: 0402 capacitor; Manufacturer: Taiyo Yuden; Manufacturer Part Number: EMK105B7104KVHF; Voltage Rating: 16V; Tolerance: 10%; Dielectric: X7R; Supplier 1: Digi-Key; Stock 1: 97505; Pricing 1: 1=0.1, 10=0.052, 100=0.0233, 500=0.01666, 1000=0.01309, 2500=0.0119, 5000=0.01095 (USD); Mount: Surface Mount; Case/Package: 0402; Weight: 2.3E-05oz; Case Code (Metric): 1005; Case Code (Imperial): 0402; Min Operating Temperature: -55°C; Max Operating Temperature: 125°C; Capacitance: 100nF; Package Quantity: 10000; Packaging: Tape and Reel; Termination: SMD/SMT; Voltage Rating (DC): 16V; Length: 0.039inch; Height: 0.5mm; Width: 0.02inch; Thickness: 0.022inch; Ratings: AEC-Q200; Lead Free: Lead Free; Halogen Free: Halogen Free; ComponentLink1URL: http://www.yuden.co.jp/ut/product/category/capacitor/putpdf/EMK105B7104KVHF_SS.pdf?src-supplier=Avnet; ComponentLink1Description: http://www.yuden.co.jp/ut/product/category/capacitor/putpdf/EMK105B7104KVHF_SS.pdf?src-supplier=Avnet; ComponentLink2URL: http://ds.yuden.co.jp/TYCOMPAS/ut/detail.do?productNo=EMK105B7104KVHF&fileName=EMK105B7104KVHF_SS&mode=specSheetDownload&src-supplier=Digi-Key; ComponentLink2Description: http://ds.yuden.co.jp/TYCOMPAS/ut/detail.do?productNo=EMK105B7104KVHF&fileName=EMK105B7104KVHF_SS&mode=specSheetDownload&src-supplier=Digi-Key; ComponentLink3URL: https://www.yuden.co.jp/productdata/catalog/mlcc01_hq_e.pdf?src-supplier=Digi-Key; ComponentLink3Description: https://www.yuden.co.jp/productdata/catalog/mlcc01_hq_e.pdf?src-supplier=Digi-Key; ComponentLink4URL: http://www.mouser.com/ds/2/396/mlcc11_hq_e-541564.pdf?src-supplier=Mouser; ComponentLink4Description: http://www.mouser.com/ds/2/396/mlcc11_hq_e-541564.pdf?src-supplier=Mouser
C2 = CAP0402: 0402 capacitor
C68 C69 = Cap: Capacitor; Published: 8-Jun-2000; LatestRevisionDate: 17-Jul-2002; LatestRevisionNote: Re-released for DXP Platform.; PackageReference: RAD-0.3; Publisher: Altium Limited; PackageDescription: Radial Cap, Thru-Hole; 2 Leads; 0.3 in Pin Spacing
C70 C71 = CAP1206: 1206 capacitor
J5 = IPBT-102-H1-T-S-RA-K: Samtec Connector Through Hole, Right Angle 2 pos 0.165" (4.20mm) pitch; Supplier 1: Digi-Key; Supplier Part Number 1: SAM9552-ND
J6 = DF13A-2P-1.25H(21): as HEAT1 on sheet heaters-sensors; Supplier 1: Digi-Key
L4 = Inductor: Inductor 50Ohms @ 100MHz; Code_IEC: 1005; Published: 8-Jun-2000; LatestRevisionDate: 29-May-2009; LatestRevisionNote: IPC-7351 Footprint Added.; PackageReference: 0402-A; Publisher: Altium Limited; PackageDescription: Chip Inductor; Code_JEITA: 0402; Supplier 1: Digi-Key; Supplier 2: Digi-Key; Supplier 3: Digi-Key
R3 R6-R8 = RES0402: 0402 resistor
  R3: Supplier 1: Digi-Key; Supplier Part Number 1: 541-330XDKR-ND
R4 = RES0402: 0402 resistor; Manufacturer: Panasonic; Manufacturer Part Number: ERA-2AED272X; Resistance: 2.7kR; Tolerance: 0.5%; Power Rating: 63mW; Voltage Rating: 25V; Temperature Coefficient: 25ppm/°C; Supplier 1: Digi-Key; Stock 1: 37826; Pricing 1: 1=0.22, 10=0.188, 100=0.0735, 1000=0.03077, 2500=0.0282, 5000=0.02564 (USD); Mount: Surface Mount; Case/Package: 0402; Case Code (Metric): 1005; Case Code (Imperial): 0402; Contact Plating: Tin; Min Operating Temperature: -55°C; Max Operating Temperature: 155°C; Packaging: Tape and Reel; Package Quantity: 1; Composition: Thin Film,Metal Film; Number of Terminations: 2; Max Power Dissipation: 63mW; Voltage Rating (DC): 25V; Features: Automotive AEC-Q200; Length: 0.039inch; Height: 0.016inch; Width: 0.02inch; REACH SVHC: No SVHC; Lead Free: Lead Free; ComponentLink1URL: http://www.farnell.com/datasheets/2059650.pdf?src-supplier=Element14; ComponentLink1Description: http://www.farnell.com/datasheets/2059650.pdf?src-supplier=Element14
R5 = RES0805: 0805 resistor; Manufacturer: Panasonic; Manufacturer Part Number: ERJ-8BWJR010V; Resistance: 10mR; Power Rating: 1W; Tolerance: 5%; Temperature Coefficient: 200ppm/°C; Supplier 1: Digi-Key; Supplier Part Number 1: P.010AVDKR-ND; Stock 1: 70650; Pricing 1: 1=0.68, 10=0.5, 100=0.2911, 1000=0.16327, 2500=0.15763 (USD); Mount: Surface Mount; Case/Package: 1206; Case Code (Imperial): 1206; Case Code (Metric): 3216; Contact Plating: Tin; Min Operating Temperature: -55°C; Max Operating Temperature: 155°C; Packaging: Tape and Reel; Package Quantity: 1; Termination: SMD/SMT; Composition: Thick Film; Number of Terminations: 2; Military Standard: Not; Max Power Dissipation: 1W; Features: Automotive AEC-Q200; Length: 3.2mm; Height: 0.65mm; Width: 1.6mm; Depth: 1.6mm; Radiation Hardening: No; Lead Free: Lead Free; ComponentLink1URL: http://industrial.panasonic.com/www-data/pdf/AOA0000/AOA0000CE3.pdf?src-supplier=Avnet; ComponentLink1Description: http://industrial.panasonic.com/www-data/pdf/AOA0000/AOA0000CE3.pdf?src-supplier=Avnet; ComponentLink2URL: https://industrial.panasonic.com/cdbs/www-data/pdf/RDN0000/AOA0000C313.pdf?src-supplier=Digi-Key; ComponentLink2Description: https://industrial.panasonic.com/cdbs/www-data/pdf/RDN0000/AOA0000C313.pdf?src-supplier=Digi-Key; ComponentLink3URL: http://uk.rs-online.com/webdocs/13b8/0900766b813b869e.pdf?src-supplier=RSComponents; ComponentLink3Description: http://uk.rs-online.com/webdocs/13b8/0900766b813b869e.pdf?src-supplier=RSComponents
R86 = Res1: Resistor; Published: 8-Jun-2000; LatestRevisionDate: 17-Jul-2002; LatestRevisionNote: Re-released for DXP Platform.; PackageReference: AXIAL-0.3; Publisher: Altium Limited; PackageDescription: Axial Device, Thru-Hole; 2 Leads; 0.3 in Pin Spacing
U7 U8 = ADA4891-1ARJZ-R7: as U4 on sheet main; Manufacturer_Part_Number: ADA4891-1ARJZ-R7; Copyright: Copyright (C) 2018 Accelerated Designs. All rights reserved; RefDes: RefDes; Type: DEV; Value: Value; Supplier 1: Digi-Key; Supplier Part Number 1: ADA4891-1ARJZ-R7CT-ND
U6 = IRL6297SDPbF: Supplier 1: Digi-Key; Supplier Part Number 1: IRL6297SDTRPBF-ND

## Sheet dep-switches.SchDoc
size A4
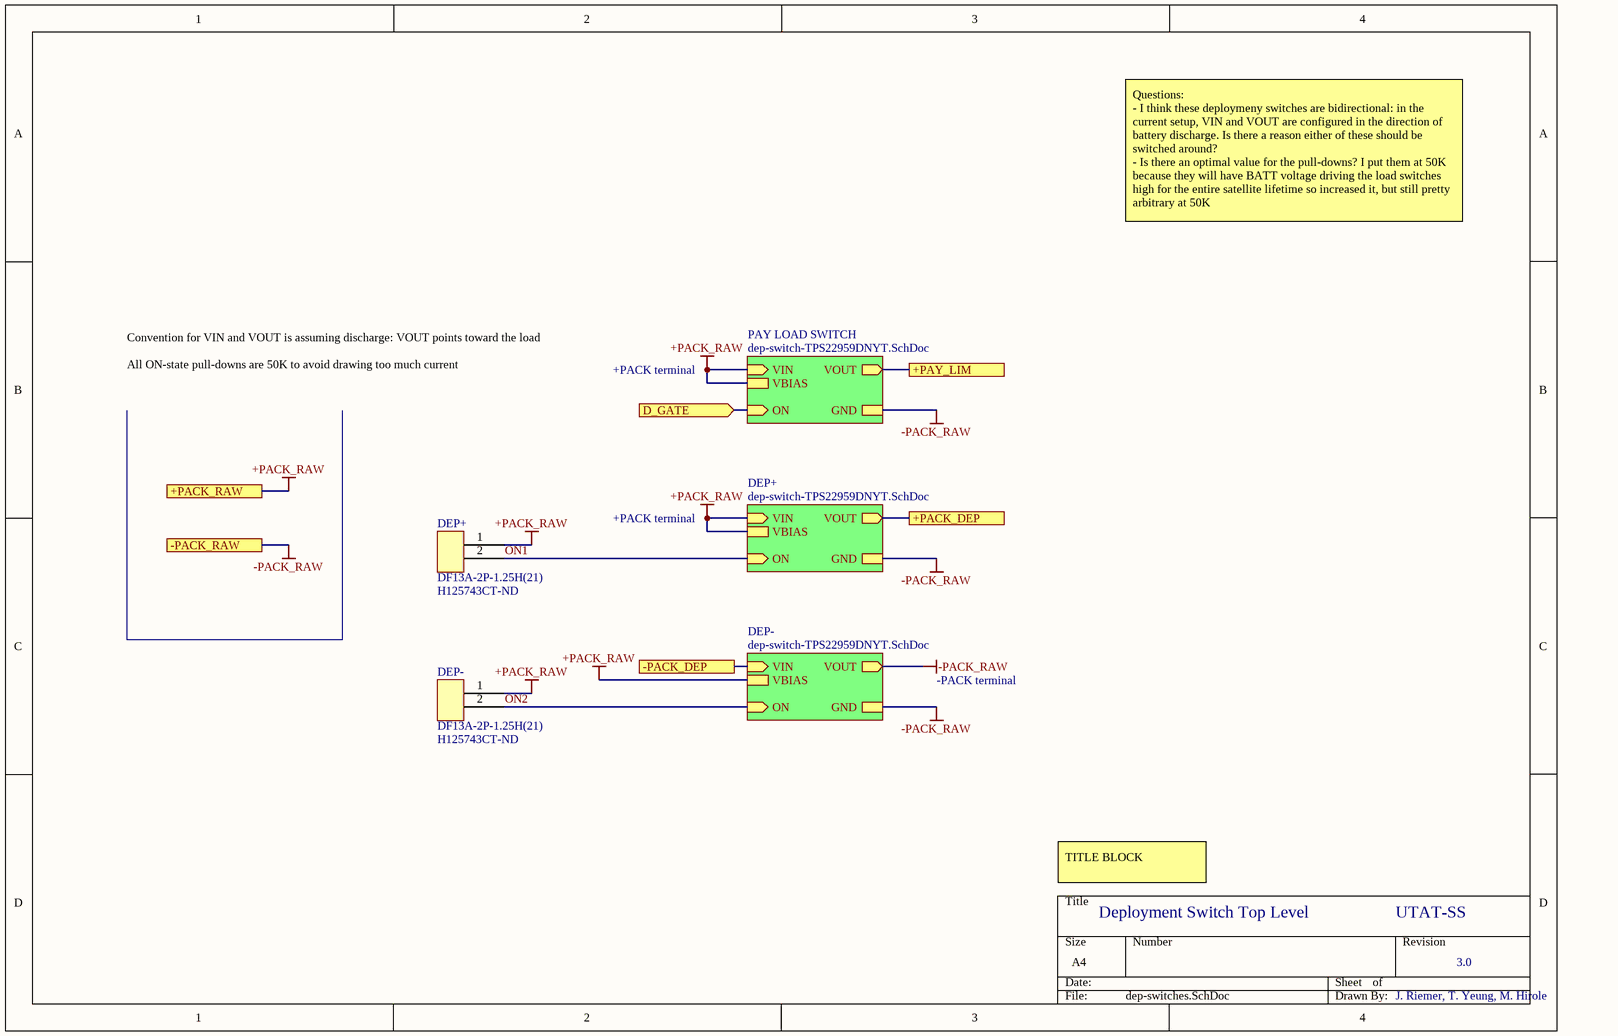
[diagram p6: dep-switches.SchDoc]

### Parts
DEP+  DF13A-2P-1.25H(21)  Supplier Part Number 1: H125743CT-ND  [DF13A-2P-1.25H(21)]
DEP-  DF13A-2P-1.25H(21)  Supplier Part Number 1: H125743CT-ND  [DF13A-2P-1.25H(21)]

### Sub-sheets
DEP+ = dep-switch-TPS22959DNYT.SchDoc: VOUT (out), VIN (in), GND, VBIAS, ON (in)
DEP- = dep-switch-TPS22959DNYT.SchDoc: VOUT (out), VIN (in), GND, VBIAS, ON (in)
PAY LOAD SWITCH = dep-switch-TPS22959DNYT.SchDoc: VOUT (out), VIN (in), GND, VBIAS, ON (in)

### Ports
+PACK_DEP, +PACK_RAW, +PAY_LIM, -PACK_DEP, -PACK_RAW, D_GATE (in)

### Nets
+PACK_RAW: DEP+.1 DEP-.1 ; port +PACK_RAW, sheet DEP+/VIN, sheet DEP+/VBIAS, sheet DEP-/VBIAS, sheet PAY LOAD SWITCH/VIN, sheet PAY LOAD SWITCH/VBIAS
-PACK_RAW: port -PACK_RAW, sheet DEP+/GND, sheet DEP-/VOUT, sheet DEP-/GND, sheet PAY LOAD SWITCH/GND
+PACK_DEP: port +PACK_DEP, sheet DEP+/VOUT
+PAY_LIM: port +PAY_LIM, sheet PAY LOAD SWITCH/VOUT
-PACK_DEP: port -PACK_DEP, sheet DEP-/VIN
D_GATE: port D_GATE, sheet PAY LOAD SWITCH/ON
ON1: DEP+.2 ; sheet DEP+/ON
ON2: DEP-.2 ; sheet DEP-/ON

### Notes on the sheet
- Questions:
  - I think these deploymeny switches are bidirectional: in the current setup, VIN and VOUT are configured in the direction of battery discharge. Is there a reason either of these should be switched around?
  - Is there an optimal value for the pull-downs? I put them at 50K because they will have BATT voltage driving the load switches high for the entire satellite lifetime so increased it, but still pretty arbitrary at 50K
- +PACK terminal
- Convention for VIN and VOUT is assuming discharge: VOUT points toward the load
  All ON-state pull-downs are 50K to avoid drawing too much current
- -PACK terminal
- TITLE BLOCK
- Deployment Switch Top Level
- UTAT-SS
- 3.0
- J. Riemer, T. Yeung, M. Hirole

### Library data of the parts
DEP+ DEP- = DF13A-2P-1.25H(21): as HEAT1 on sheet heaters-sensors; Supplier 1: Digi-Key

## Sheet dep-switch-TPS22959DNYT.SchDoc
size A4
Used 4 times, as channels MAIN/BATTERY/LOAD SWITCHES/DEP+, MAIN/BATTERY/LOAD SWITCHES/DEP-, MAIN/BATTERY/LOAD SWITCHES/PAY LOAD SWITCH, MAIN/BATTERY/RBF. Parts and nets are listed once, with the designators drawn on the sheet.
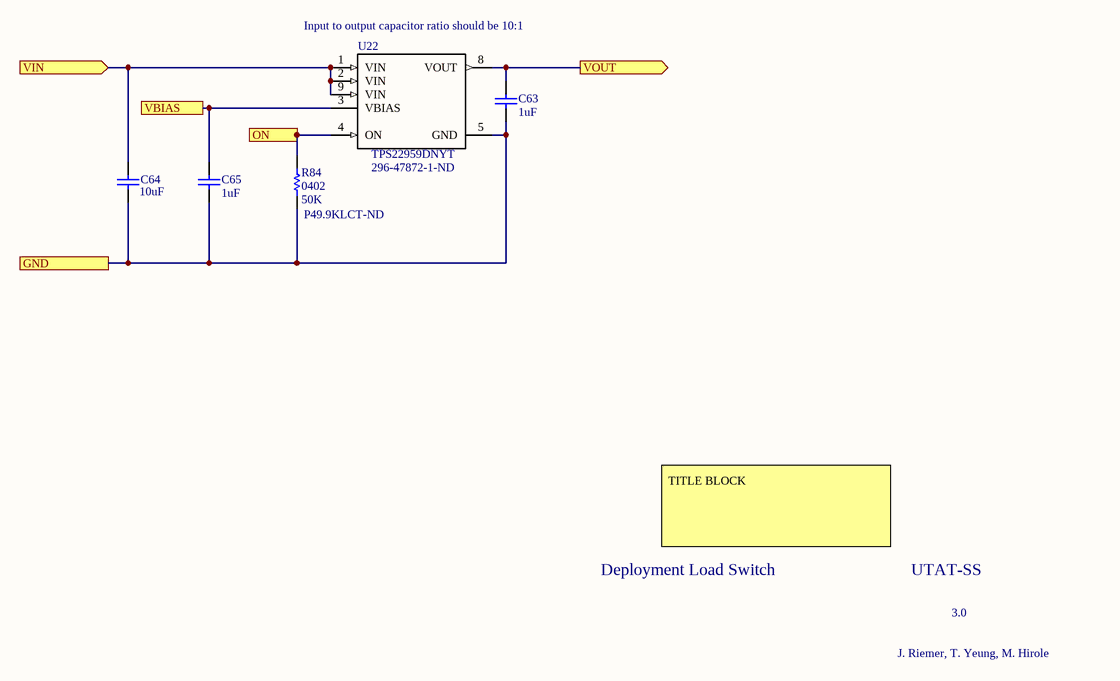
[diagram p7: dep-switch-TPS22959DNYT.SchDoc]

### Parts
C63  value 1uF  [CAP0603R]  (hidden comment: 0603)
C64  value 10uF  [CAP0805R]  (hidden comment: 0805)
C65  value 1uF  [CAP0603R]  (hidden comment: 0603)
R84  0402  value 50K  Supplier Part Number 1: P49.9KLCT-ND  [RES0402R]
U22  TPS22959DNYT  Supplier Part Number 1: 296-47872-1-ND  [TPS22959DNYT]

### Ports
GND, ON (in), VBIAS, VIN (in), VOUT (out)

### Nets
GND: C63.1 C64.1 C65.1 R84.1 U22.5(GND) ; port GND
ON: R84.2 U22.4(ON) ; port ON
VBIAS: C65.2 U22.3(VBIAS) ; port VBIAS
VIN: C64.2 U22.1(VIN) U22.2(VIN) U22.9(VIN) ; port VIN
VOUT: C63.2 U22.8(VOUT) ; port VOUT

### Channels
MAIN/BATTERY/LOAD SWITCHES/DEP+: designators end in _DEP+; ports GND=-PACK_RAW ON=ON1 VBIAS=+PACK_RAW VIN=+PACK_RAW VOUT=+PACK_DEP
MAIN/BATTERY/LOAD SWITCHES/DEP-: designators end in _DEP-; ports GND=-PACK_RAW ON=ON2 VBIAS=+PACK_RAW VIN=-PACK_DEP VOUT=-PACK_RAW
MAIN/BATTERY/LOAD SWITCHES/PAY LOAD SWITCH: designators end in _PAY_LOAD_SWITCH; ports GND=-PACK_RAW ON=D_GATE VBIAS=+PACK_RAW VIN=+PACK_RAW VOUT=+PAY_LIM
MAIN/BATTERY/RBF: designators end in _RBF; ports GND=-PACK_RAW ON=NetJ6_1 VBIAS=+PACK_RAW VIN=-PACK_RBF VOUT=-PACK_DEP

### Notes on the sheet
- (near U22) Input to output capacitor ratio should be 10:1
- Deployment Load Switch
- TITLE BLOCK
- UTAT-SS
- 3.0
- J. Riemer, T. Yeung, M. Hirole

### Library data of the parts
C63 C65 = CAP0603: 0603 capacitor; Supplier 1: Digi-Key; Supplier Part Number 1: 1276-6524-6-ND; ComponentLink1Description: Datasheet; ComponentLink1URL: https://media.digikey.com/pdf/Data%20Sheets/Samsung%20PDFs/CL10B105MO8NNWC.pdf
C64 = CAP0805: 0805 capacitor; Supplier 1: Digi-Key; Supplier Part Number 1: 490-14381-6-ND; ComponentLink1Description: Datasheet; ComponentLink1URL: https://search.murata.co.jp/Ceramy/image/img/A01X/G101/ENG/GRM21BR71A106KA73-01.pdf
R84 = RES0402: 0402 resistor; Manufacturer: Panasonic; Manufacturer Part Number: ERJ-2RKF4992X; Description: PANASONIC ELECTRONIC COMPONENTS - ERJ-2RKF4992X. - Resistance:49.9kohm; Power Rating: 100mW; Resistance: 49.9kR; Tolerance: 1%; Voltage Rating: 50V; Temperature Coefficient: 100ppm/°C; Supplier 1: Digi-Key; Stock 1: 1480214; Pricing 1: 1=0.1, 10=0.045, 100=0.0183, 1000=0.00823, 2500=0.00715, 5000=0.0059 (USD); Mount: Surface Mount; Case/Package: 0402; Case Code (Metric): 1005; Case Code (Imperial): 0402; Contact Plating: Tin; Min Operating Temperature: -55°C; Max Operating Temperature: 155°C; Packaging: Tape and Reel; Package Quantity: 1; Composition: Thick Film; Number of Terminations: 2; Termination: SMD/SMT; Military Standard: Not; Max Power Dissipation: 100mW; Voltage Rating (DC): 50V; Features: Automotive AEC-Q200; Length: 1mm; Height: 0.35mm; Width: 0.02inch; Depth: 0.5mm; Radiation Hardening: No; REACH SVHC: No SVHC; Lead Free: Lead Free; ComponentLink1URL: http://www.jameco.com/Jameco/Products/ProdDS/1987353.pdf?src-supplier=Jameco; ComponentLink1Description: http://www.jameco.com/Jameco/Products/ProdDS/1987353.pdf?src-supplier=Jameco; ComponentLink2URL: http://industrial.panasonic.com/www-data/pdf/AOA0000/AOA0000CE2.pdf?src-supplier=Avnet; ComponentLink2Description: http://industrial.panasonic.com/www-data/pdf/AOA0000/AOA0000CE2.pdf?src-supplier=Avnet; ComponentLink3URL: http://industrial.panasonic.com/www-data/pdf/AOA0000/AOA0000CE2.pdf?src-supplier=Future+Electronics; ComponentLink3Description: http://industrial.panasonic.com/www-data/pdf/AOA0000/AOA0000CE2.pdf?src-supplier=Future+Electronics; ComponentLink4URL: http://industrial.panasonic.com/cdbs/www-data/pdf/RDA0000/AOA0000C304.pdf?src-supplier=Farnell; ComponentLink4Description: http://industrial.panasonic.com/cdbs/www-data/pdf/RDA0000/AOA0000C304.pdf?src-supplier=Farnell; ComponentLink5URL: http://www.farnell.com/datasheets/1678782.pdf?src-supplier=Element14; ComponentLink5Description: http://www.farnell.com/datasheets/1678782.pdf?src-supplier=Element14; ComponentLink6URL: https://www.alliedelec.com/m/d/623f45ff1957d936ff56d46fd1c28cac.pdf?src-supplier=Allied+Electronics; ComponentLink6Description: https://www.alliedelec.com/m/d/623f45ff1957d936ff56d46fd1c28cac.pdf?src-supplier=Allied+Electronics; ComponentLink7URL: http://www.farnell.com/datasheets/426256.pdf?src-supplier=Element14; ComponentLink7Description: http://www.farnell.com/datasheets/426256.pdf?src-supplier=Element14
U22 = TPS22959DNYT: 5.5V, 15A, 4.4mÎ© Load Switch with Quick Output Discharge 8-WSON -40 to 85; MF: Texas Instruments; Number of Outputs: 1; Quiescent Current: 20.4uA; Package: WSON-8 Texas Instruments; Digi-Key_Part_Number: 296-47872-1-ND; Digi-Key_Purchase_URL: https://www.digikey.ca/product-detail/en/texas-instruments/TPS22959DNYT/296-47872-1-ND/8133221?utm_source=snapeda&utm_medium=aggregator&utm_campaign=symbol; SnapEDA_Link: https://www.snapeda.com/parts/TPS22959DNYT/Texas%20Instruments/view-part/?ref=snap; MP: TPS22959DNYT; Value: *; Supplier 1: Digi-Key; Manufacturer: Texas Instruments; Manufacturer Part Number: TPS22959DNYT; Stock 1: 2432; Pricing 1: 1=1.91, 10=1.711, 100=1.3756 (USD); Mount: Surface Mount; Number of Pins: 8; Min Operating Temperature: -40°C; Max Operating Temperature: 85°C; Number of Channels: 1; Lead Free: Lead Free; ComponentLink1URL: http://www.ti.com/general/docs/lit/getliterature.tsp?genericPartNumber=TPS22959&&fileType=pdf&src-supplier=Avnet; ComponentLink1Description: http://www.ti.com/general/docs/lit/getliterature.tsp?genericPartNumber=TPS22959&&fileType=pdf&src-supplier=Avnet

## Sheet current-limiter.SchDoc
size A4
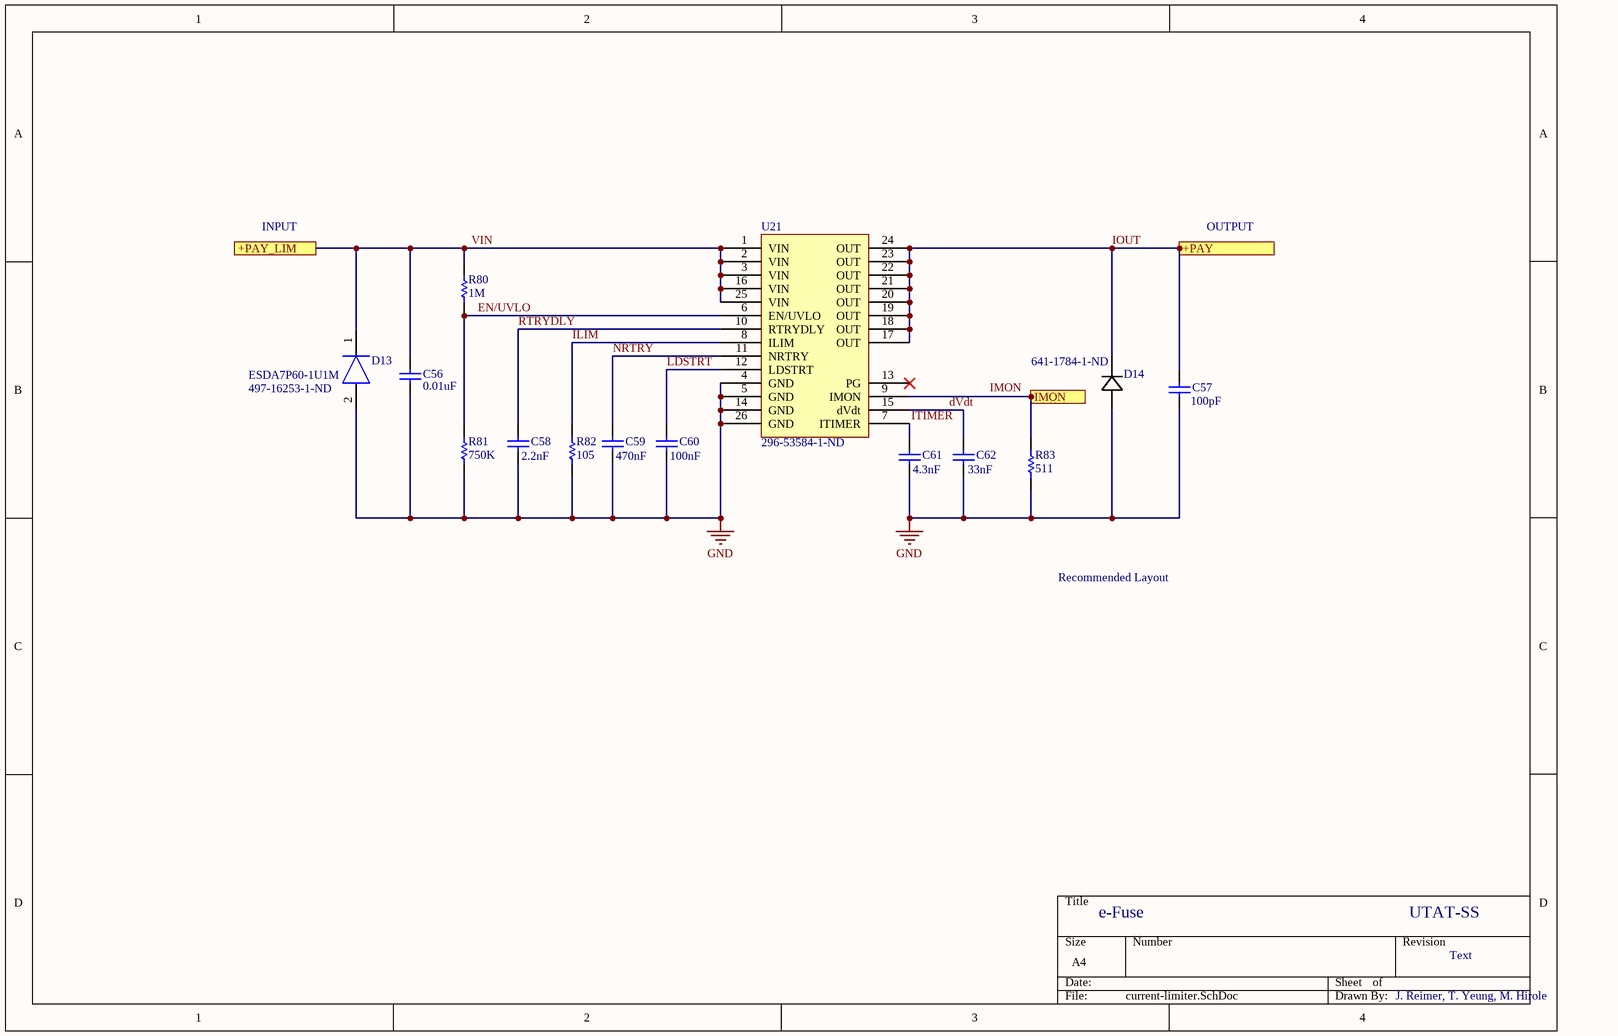
[diagram p8: current-limiter.SchDoc]

### Parts
C56  value 0.01uF  [CAP0603R]  (hidden comment: 0603)
C57  value 100pF  [CAP0603R]  (hidden comment: 0603)
C58  value 2.2nF  [CAP0402R]  (hidden comment: 0402)
C59  value 470nF  [CAP0402R]  (hidden comment: 0402)
C60  value 100nF  [CAP0402R]  (hidden comment: 0402)
C61  value 4.3nF  [CAP0402R]  (hidden comment: 0402)
C62  value 33nF  [CAP0402R]  (hidden comment: 0402)
D13  ESDA7P60-1U1M  Supplier Part Number 1: 497-16253-1-ND  [ESDA7P601U1M]
D14  Supplier Part Number 1: 641-1784-1-ND  [ESC]  (hidden comment: Part Number: 1SS389)
R80  value 1M  [RES0402R]  (hidden comment: 0402)
R81  value 750K  [RES0402R]  (hidden comment: 0402)
R82  value 105  [RES0402R]  (hidden comment: 0402)
R83  value 511  [RES0402R]  (hidden comment: 0402)
U21  Supplier Part Number 1: 296-53584-1-ND  [RGE0024M]  (hidden comment: eFuse)

### Ports
+PAY, +PAY_LIM, IMON (out)

### Nets
GND: C56.1 C57.1 C58.1 C59.1 C60.1 C61.1 C62.1 D13.2(A) D14.2(ANODE) R81.1 R82.1 R83.1 U21.4(GND) U21.5(GND) U21.14(GND) U21.26(GND)
IOUT: C57.2 D14.1(CATHODE) U21.17(OUT) U21.18(OUT) U21.19(OUT) U21.20(OUT) U21.21(OUT) U21.22(OUT) U21.23(OUT) U21.24(OUT) ; port +PAY  [project net +PAY]
dVdt: C62.2 U21.15(dVdt)
EN/UVLO: R80.1 R81.2 U21.6(EN/UVLO)
ILIM: R82.2 U21.8(ILIM)
LDSTRT: C60.2 U21.12(LDSTRT)
NRTRY: C59.2 U21.11(NRTRY)
RTRYDLY: C58.2 U21.10(RTRYDLY)
VIN: C56.2 D13.1(K) R80.2 U21.1(VIN) U21.2(VIN) U21.3(VIN) U21.16(VIN) U21.25(VIN) ; port +PAY_LIM  [project net +PAY_LIM]
NetC61_2: C61.2 U21.7(ITIMER)
NetR83_2: R83.2 U21.9(IMON) ; port IMON

Not connected (* = marked no-connect by the designer): U21 13(PG)*

### Notes on the sheet
- INPUT
- OUTPUT
- Recommended Layout
- e-Fuse
- UTAT-SS
- Text
- J. Reimer, T. Yeung, M. Hirole
- Labels drawn without touching a wire or pin: IMON, ITIMER

### Library data of the parts
C56 C57 = CAP0603: 0603 capacitor; Supplier 1: Digi-Key
  C56: Supplier Part Number 1: 490-9729-1-ND
  C57: Supplier Part Number 1: 490-4767-6-ND
C58-C62 = CAP0402: 0402 capacitor; Supplier 1: Digi-Key
  C58: Supplier Part Number 1: 490-4914-6-ND
  C59: Supplier Part Number 1: 490-3264-6-ND
  C60: Supplier Part Number 1: 490-6328-6-ND
  C61: Supplier Part Number 1: 490-8245-6-ND
  C62: Supplier Part Number 1: 490-11984-6-ND
D13 = ESDA7P60-1U1M: Diode; Manufacturer_Name: STMicroelectronics; Number of Unidirectional Channels: 1; Reverse Standoff Voltage: 5V; Min Breakdown Voltage: 6.4V; Clamping Voltage: 11.6V; Peak Pulse Power: 700W; Power Line Protection: No; Polarity: Unidirectional; Max Breakdown Voltage: 7.2V; Peak Pulse Current: 60A; Datasheet Link: https://www.st.com/resource/en/datasheet/esda7p60-1u1m.pdf; Height: 0.6mm; Manufacturer_Part_Number: ESDA7P60-1U1M; Mouser Part Number: 511-ESDA7P60-1U1M; Mouser Price/Stock: https://www.mouser.com/Search/Refine.aspx?Keyword=511-ESDA7P60-1U1M; RS Part Number: 1106381P; RS Price/Stock: http://uk.rs-online.com/web/p/products/1106381P; Supplier 1: Digi-Key; Manufacturer: STMicroelectronics; Manufacturer Part Number: ESDA7P60-1U1M; Stock 1: 16331; Pricing 1: 1=0.45, 10=0.363, 100=0.2472, 500=0.1854, 1000=0.13905, 2500=0.12746 (USD); Mount: Surface Mount; Case/Package: 1610; Number of Pins: 2; Min Operating Temperature: -55°C; Max Operating Temperature: 150°C; Packaging: Cut Tape; Composition: Zener; REACH SVHC: No SVHC; ComponentLink1URL: http://www.st.com/content/ccc/resource/technical/document/datasheet/44/e9/26/44/42/ee/4f/e5/DM00139972.pdf/files/DM00139972.pdf/jcr:content/translations/en.DM00139972.pdf?src-supplier=Digi-Key; ComponentLink1Description: http://www.st.com/content/ccc/resource/technical/document/datasheet/44/e9/26/44/42/ee/4f/e5/DM00139972.pdf/files/DM00139972.pdf/jcr:content/translations/en.DM00139972.pdf?src-supplier=Digi-Key; ComponentLink2URL: http://www.farnell.com/datasheets/2041290.pdf?src-supplier=Element14; ComponentLink2Description: http://www.farnell.com/datasheets/2041290.pdf?src-supplier=Element14; ComponentLink3URL: http://www.farnell.com/datasheets/2041290.pdf?src-supplier=Farnell; ComponentLink3Description: http://www.farnell.com/datasheets/2041290.pdf?src-supplier=Farnell
D14 = 1SS389: No Description Available; Manufacturer: Comchip; Manufacturer Part Number: 1SS389-G; Built_By: EMA_Kyle; Vendor: Toshiba; Type: DEV; Description: DIODE SCHOTTKY 10V 100MA SOD523; Average Rectified Current: 100mA; Max Reverse Voltage (DC): 10V; Copyright: Copyright (C) 2016 Accelerated Designs. All rights reserved; Manufacturer_Part_Number: 1SS389; RefDes: RefDes; Value: Value; Supplier 1: Digi-Key; Stock 1: 2304; Pricing 1: 1=0.22, 10=0.184, 25=0.154, 100=0.0975, 250=0.07524, 500=0.06412, 1000=0.04361 (USD); Mount: Surface Mount; Packaging: Tape and Reel; ComponentLink1URL: http://www.comchiptech.com/cms/UserFiles/1SS389-G%20RevA305239.pdf?src-supplier=Digi-Key; ComponentLink1Description: http://www.comchiptech.com/cms/UserFiles/1SS389-G%20RevA305239.pdf?src-supplier=Digi-Key; ComponentLink2URL: http://www.comchiptech.com/admin/files/product/1SS389-G RevA305239.pdf?src-supplier=Digi-Key; ComponentLink2Description: http://www.comchiptech.com/admin/files/product/1SS389-G RevA305239.pdf?src-supplier=Digi-Key
R80-R83 = RES0402: 0402 resistor
  R80: Supplier 1: Digi-Key; Supplier Part Number 1: MCS0402-1.00M-CFDKR-ND
  R81: Supplier 1: Digi-Key; Supplier Part Number 1: YAG3228DKR-ND
U21 = TPS25982: 2.7 - 24 V input supply, 15 A max load current; Manufacturer: Texas Instruments; Manufacturer Part Number: TPS259822LNRGER; Supplier 1: Digi-Key; Stock 1: 3000; Pricing 1: 1=3.96, 10=3.559, 100=2.9163, 500=2.48262, 1000=2.09378 (USD); ComponentLink1URL: https://octopart.com/click/track?ak=2673a2b2&ct=datasheets&sig=0dd3cb2&at=physicalpart&sid=370&ppid=103121101&hlid=28341978&src-supplier=TI+store; ComponentLink1Description: https://octopart.com/click/track?ak=2673a2b2&ct=datasheets&sig=0dd3cb2&at=physicalpart&sid=370&ppid=103121101&hlid=28341978&src-supplier=TI+store; ComponentLink2URL: http://sigma.octopart.com/102096900/technical_drawing/Texas-Instruments-TPS259822LNRGER.pdf?src-supplier=TI+store; ComponentLink2Description: http://sigma.octopart.com/102096900/technical_drawing/Texas-Instruments-TPS259822LNRGER.pdf?src-supplier=TI+store